# Altium project S7CAS-PLEIADES-CARTE-FILLE.PrjPCB (part 1 of 2)
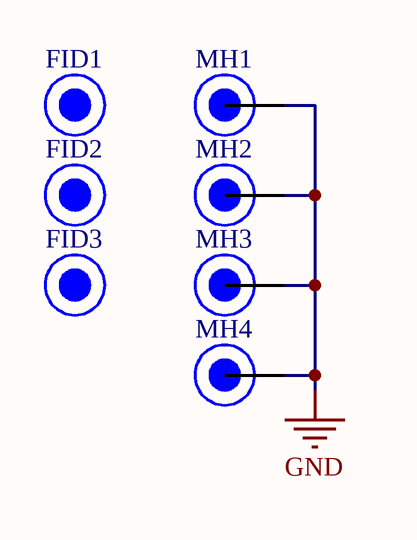
[diagram p0: CF_Title.SchDoc]
Project_Date: 2019-01-28; Project_DateCode: DCXXXX; Project_Designer1: Olivier Belval; Project_Designer2: Édouard Denommée; Project_Designer3: Philippe Marcoux; Project_Designer4: Anthony Paris; Project_Global: PLEIADES; Project_Group: P05; Project_Name: Carte Fille; Project_Revision: 1.000; Project_Stencil_Bot_Thickness: 0.1 MM; Project_Stencil_Top_Thickness: 0.1 MM
10 sheets, 201 parts. Net scope: flat (ports and power ports of the same name join across sheets).
Board file: CF_PCB.PcbDoc
Sheets:
  CF_Title.SchDoc
  CF_POWER_TREE.SchDoc
  CF_ALIM.SchDoc
  CF_DAC.SchDoc
  CF_DAC_FILTER.SchDoc
  CF_ADC.SchDoc
  CF_ADC_Supply.SchDoc
  CF_ADC_filter.SchDoc
  CF_FMC_ABC.SchDoc
  CF_FMC_DE.SchDoc

## Sheet CF_Title.SchDoc
size Tabloid; DocumentNumber: 1; SheetNumber: 1; SheetTotal: 10; Size: 11x17

### Parts
FID1  Fiducial 1mm  [FID_1MM]  (value not drawn)  (no BOM)
FID2  Fiducial 1mm  [FID_1MM]  (value not drawn)  (no BOM)
FID3  Fiducial 1mm  [FID_1MM]  (value not drawn)  (no BOM)
MH1  Mounting Hole 6-32  [MH_ENG_6-32]  (value not drawn)  (no BOM)
MH2  Mounting Hole 6-32  [MH_ENG_6-32]  (value not drawn)  (no BOM)
MH3  Mounting Hole 6-32  [MH_ENG_6-32]  (value not drawn)  (no BOM)
MH4  Mounting Hole 6-32  [MH_ENG_6-32]  (value not drawn)  (no BOM)

### Nets
GND: MH1.1 MH2.1 MH3.1 MH4.1

### Notes on the sheet
- Revision history
- Package size conversion
- Metric
- 1005
- 1608
- Imperial
- 0402
- 0603
- Revision
- 2012
- 3216
- 0805
- 1206
- 3225
- 6432
- 1210
- 2512
- Date :
- Project Title
- Global Project
- Size
- Group
- Date
- Sheet
- of
- Filename
- Designers

### Library data of the parts
FID1-FID3 = FID_1MM: FID - 1MM; Current: *; Mfg Part Number: *; HelpURL: *; CreatedBy: Jonathan Bouchard; VerifiedBy: Alexandre Imbeault; FootprintNameOK: Jonathan Bouchard; Temperature: *; Power: *; Precision: *; Value: *; Mfg: *; Package: *; Voltage: *
MH1-MH4 = MH_6-32: MH - Mounting Hole 6-32; Current: *; Mfg Part Number: *; HelpURL: *; CreatedBy: Jonathan Bouchard; VerifiedBy: Alexandre Imbeault; FootprintNameOK: Jonathan Bouchard; Temperature: *; Power: *; Precision: *; Value: *; Mfg: *; Package: *; Voltage: *

## Sheet CF_POWER_TREE.SchDoc
size Tabloid; DocumentNumber: 2; SheetNumber: 2; SheetTotal: 10; Size: 11x17; Sheet_Name: Power tree
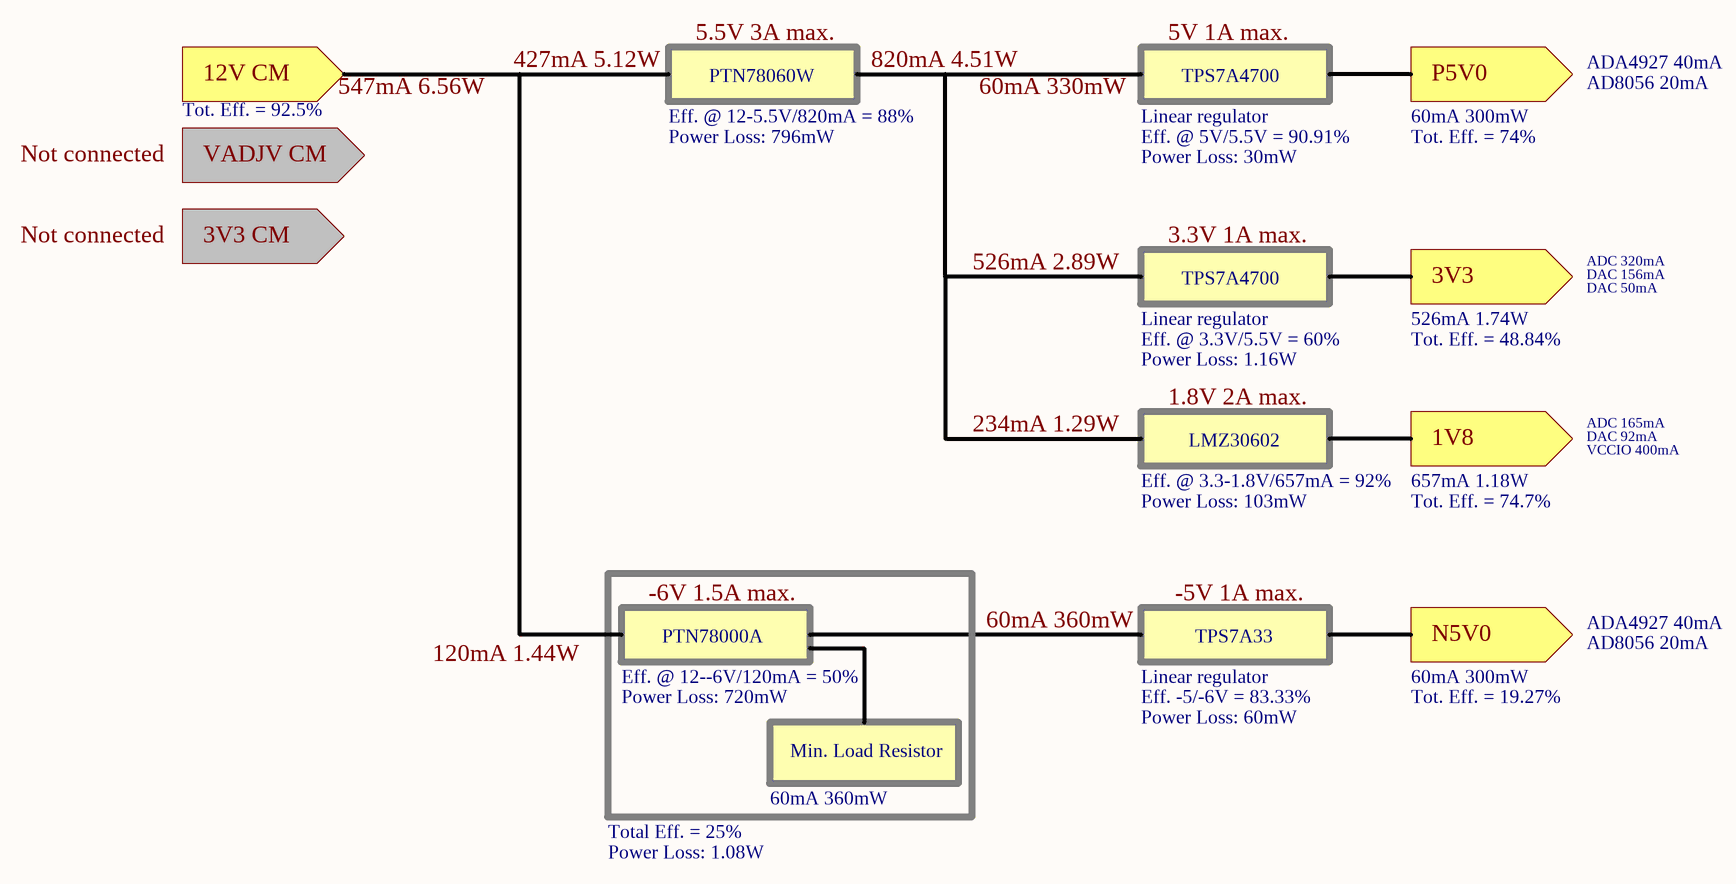
[diagram p1: CF_POWER_TREE.SchDoc]

### Notes on the sheet
- 5.5V 3A max.
- 5V 1A max.
- 12V CM
- 547mA 6.56W
- 427mA 5.12W
- PTN78060W
- 820mA 4.51W
- 60mA 330mW
- TPS7A4700
- P5V0
- ADA4927 40mA
- AD8056 20mA
- Not connected
- Tot. Eff. = 92.5%
- VADJV CM
- Power Loss: 796mW
- Eff. @ 12-5.5V/820mA = 88%
- Power Loss: 30mW
- Eff. @ 5V/5.5V = 90.91%
- Linear regulator
- 60mA 300mW
- Tot. Eff. = 74%
- 3V3 CM
- 526mA 2.89W
- 3.3V 1A max.
- 3V3
- ADC 320mA
- DAC 156mA
- DAC 50mA
- Power Loss: 1.16W
- Eff. @ 3.3V/5.5V = 60%
- 526mA 1.74W
- Tot. Eff. = 48.84%
- 234mA 1.29W
- 1.8V 2A max.
- LMZ30602
- 1V8
- ADC 165mA
- DAC 92mA
- Power Loss: 103mW
- Eff. @ 3.3-1.8V/657mA = 92%
- 657mA 1.18W
- Tot. Eff. = 74.7%
- VCCIO 400mA
- -6V 1.5A max.
- PTN78000A
- 60mA 360mW
- -5V 1A max.
- TPS7A33
- N5V0
- 120mA 1.44W
- Power Loss: 720mW
- Eff. @ 12--6V/120mA = 50%
- Eff. -5/-6V = 83.33%
- Tot. Eff. = 19.27%
- Min. Load Resistor
- Power Loss: 60mW
- Total Eff. = 25%
- Power Loss: 1.08W
- Sheet Name
- Project Title
- Global Project
- Size
- Group
- Revision
- Date
- Sheet
- of
- Filename
- Designers

## Sheet CF_ALIM.SchDoc: CF_ALIM
size Tabloid; DocumentNumber: 3; SheetNumber: 3; SheetTotal: 10; SheetName: test; Sheet_Name: CF_ALIM; Size: 11x17; DocumentName: CF_ALIM
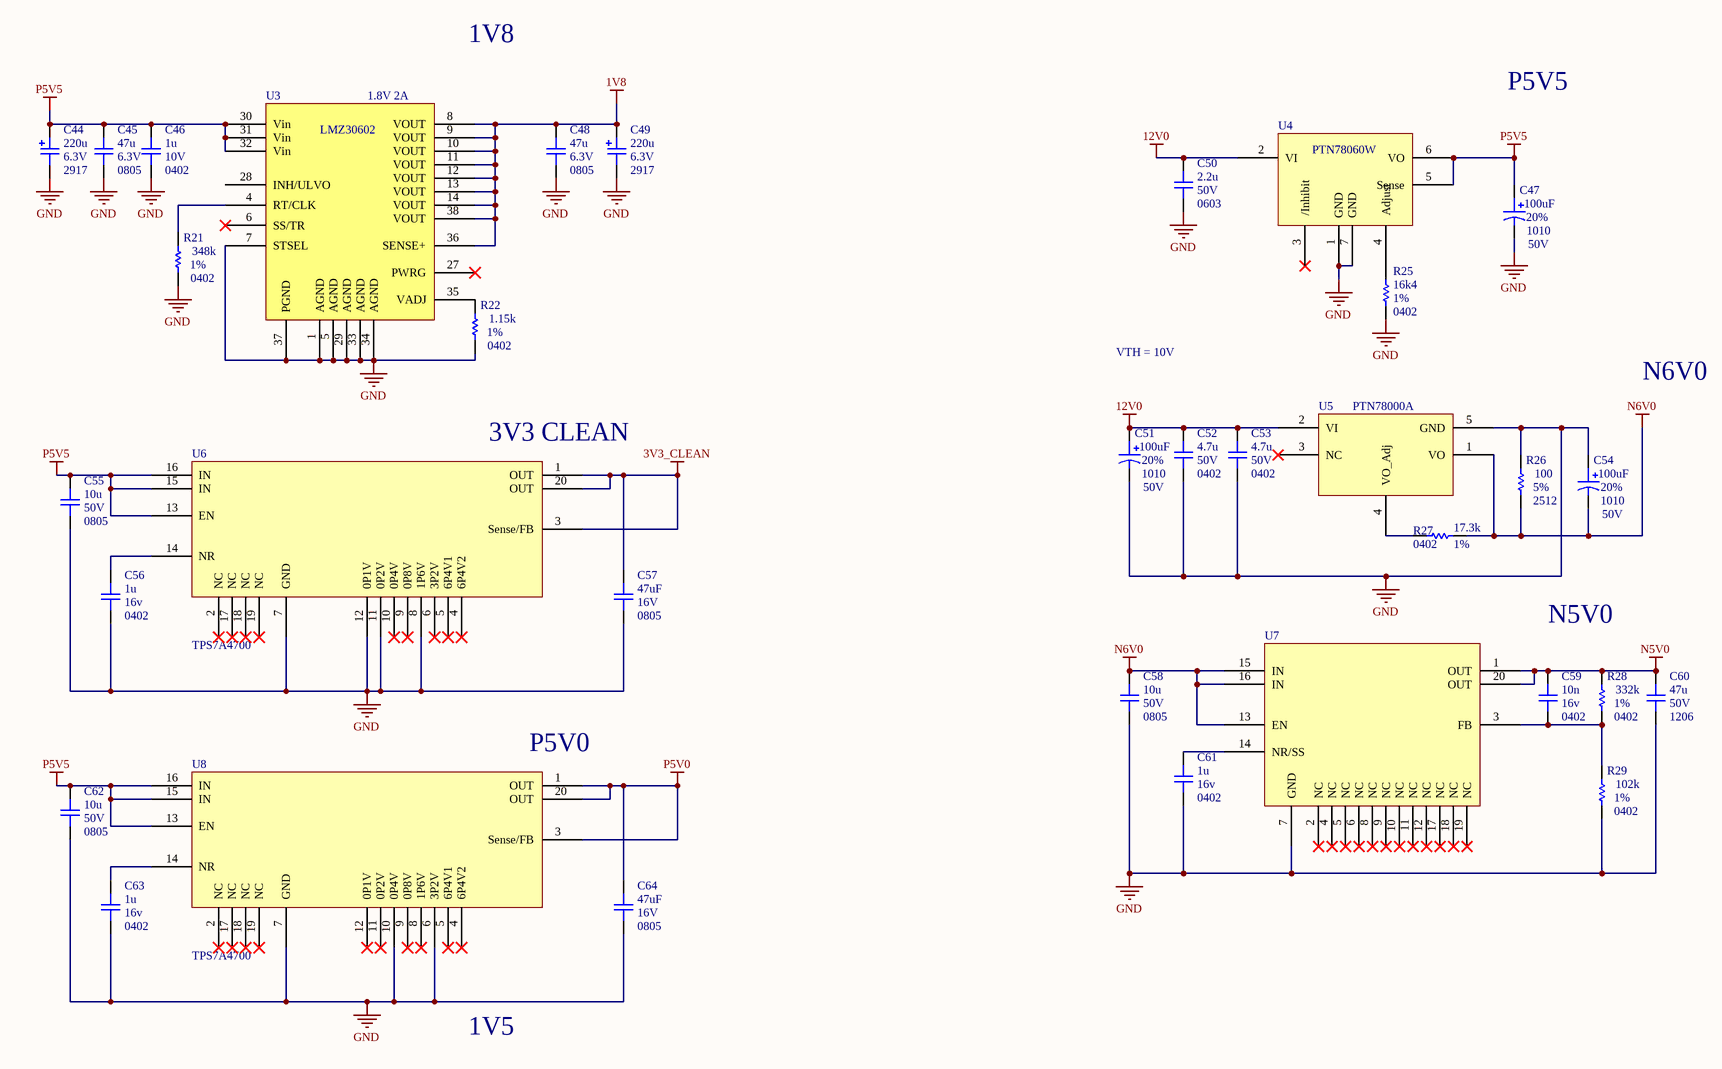
[diagram p2: CF_ALIM.SchDoc]

### Parts
C44  value 220u  Voltage: 6.3V  Package: 2917  [CAP_TAN_2917(D)]  (hidden comment: CAP - TANTALUM - CASE D)
C45  value 47u  Voltage: 6.3V  Package: 0805  [CAP_0805]  (hidden comment: CAP - 0805)
C46  value 1u  Voltage: 10V  Package: 0402  [CAP_0402]  (hidden comment: CAP - 0402)
C47  value 100uF  Voltage: 50V  Package: 1010  Precision: 20%  [CapacitorE]  (hidden comment: MAL215099101E3)
C48  value 47u  Voltage: 6.3V  Package: 0805  [CAP_0805]  (hidden comment: CAP - 0805)
C49  value 220u  Voltage: 6.3V  Package: 2917  [CAP_TAN_2917(D)]  (hidden comment: CAP - TANTALUM - CASE D)
C50  value 2.2u  Voltage: 50V  Package: 0603  [CAP_0603]  (hidden comment: CAP - 0603)
C51  value 100uF  Voltage: 50V  Package: 1010  Precision: 20%  [CapacitorE]  (hidden comment: MAL215099101E3)
C52  value 4.7u  Voltage: 50V  Package: 0402  [CAP_0402]  (hidden comment: CAP - 0402)
C53  value 4.7u  Voltage: 50V  Package: 0402  [CAP_0402]  (hidden comment: CAP - 0402)
C54  value 100uF  Voltage: 50V  Package: 1010  Precision: 20%  [CapacitorE]  (hidden comment: MAL215099101E3)
C55  value 10u  Voltage: 50V  Package: 0805  [CAP_0402]  (hidden comment: CAP - 0402)
C56  value 1u  Voltage: 16v  Package: 0402  [CAP_0402]  (hidden comment: CAP - 0402)
C57  value 47uF  Voltage: 16V  Package: 0805  [CAP_0805]  (hidden comment: CAP - 0805)
C58  value 10u  Voltage: 50V  Package: 0805  [CAP_0402]  (hidden comment: CAP - 0402)
C59  value 10n  Voltage: 16v  Package: 0402  [CAP_0402]  (hidden comment: CAP - 0402)
C60  value 47u  Voltage: 50V  Package: 1206  [CAP_1206]  (hidden comment: CAP - 1206)
C61  value 1u  Voltage: 16v  Package: 0402  [CAP_0402]  (hidden comment: CAP - 0402)
C62  value 10u  Voltage: 50V  Package: 0805  [CAP_0402]  (hidden comment: CAP - 0402)
C63  value 1u  Voltage: 16v  Package: 0402  [CAP_0402]  (hidden comment: CAP - 0402)
C64  value 47uF  Voltage: 16V  Package: 0805  [CAP_0805]  (hidden comment: CAP - 0805)
R21  value 348k  Package: 0402  Precision: 1%  [RES_0402]  (hidden comment: RES - 0402)
R22  value 1.15k  Package: 0402  Precision: 1%  [RES_0402]  (hidden comment: RES - 0402)
R25  value 16k4  Package: 0402  Precision: 1%  [RES_0402]  (hidden comment: RES - 0402)
R26  value 100  Package: 2512  Precision: 5%  [C2512]  (hidden comment: RES - 0402)
R27  value 17.3k  Package: 0402  Precision: 1%  [RES_0402]  (hidden comment: RES - 0402)
R28  value 332k  Package: 0402  Precision: 1%  [RES_0402]  (hidden comment: RES - 0402)
R29  value 102k  Package: 0402  Precision: 1%  [RES_0402]  (hidden comment: RES - 0402)
U3  LMZ30602  [RKG39 QFN]
U4  PTN78060W  [EUW]
U5  PTN78000A  [PTN78000A]
U6  TPS7A4700  [TPS7A4700]
U7  (no value)  [TPS7A4700]
U8  TPS7A4700  [TPS7A4700]

### Nets
1V8: C48.2 C49.2 U3.8(VOUT) U3.9(VOUT) U3.10(VOUT) U3.11(VOUT) U3.12(VOUT) U3.13(VOUT) U3.14(VOUT) U3.36(SENSE+) U3.38(VOUT)
3V3_CLEAN: C57.2 U6.1(OUT) U6.3(Sense/FB) U6.20(OUT)
12V0: C50.2 C51.1 C52.2 C53.2 U4.2(VI) U5.2(VI)
GND: C44.1 C45.1 C46.1 C47.2 C48.1 C49.1 C50.1 C51.2 C52.1 C53.1 C54.1 C55.1 C56.1 C57.1 C58.1 C60.1 C61.1 C62.1 C63.1 C64.1 R21.1 R22.1 R25.1 R26.2 R29.1 U3.1(AGND) U3.5(AGND) U3.7(STSEL) U3.29(AGND) U3.33(AGND) U3.34(AGND) U3.37(PGND) U4.1(GND) U4.7(GND) U5.5(GND) U6.7(GND) U6.8(1P6V) U6.11(0P2V) U6.12(0P1V) U7.7(GND) U8.6(3P2V) U8.7(GND) U8.10(0P4V)
N5V0: C59.2 C60.2 R28.2 U7.1(OUT) U7.20(OUT)
N6V0: C54.2 C58.2 R26.1 R27.1 U5.1(VO) U7.13(EN) U7.15(IN) U7.16(IN)
P5V0: C64.2 U8.1(OUT) U8.3(Sense/FB) U8.20(OUT)
P5V5: C44.2 C45.2 C46.2 C47.1 C55.2 C62.2 U3.30(Vin) U3.31(Vin) U3.32(Vin) U4.5(Sense) U4.6(VO) U6.13(EN) U6.15(IN) U6.16(IN) U8.13(EN) U8.15(IN) U8.16(IN)
NetC56_2: C56.2 U6.14(NR)
NetC59_1: C59.1 R28.1 R29.2 U7.3(FB)
NetC61_2: C61.2 U7.14(NR/SS)
NetC63_2: C63.2 U8.14(NR)
NetR21_2: R21.2 U3.4(RT/CLK)
NetR22_2: R22.2 U3.35(VADJ)
NetR25_2: R25.2 U4.4(Adjust)
NetR27_2: R27.2 U5.4(VO_Adj)

Not connected (* = marked no-connect by the designer): U3 6(SS/TR)* 27(PWRG)* 28(INH/ULVO); U4 3(/Inhibit)*; U5 3(NC)*; U6 2(NC)* 4(6P4V2)* 5(6P4V1)* 6(3P2V)* 9(0P8V)* 10(0P4V)* 17(NC)* 18(NC)* 19(NC)*; U7 2(NC)* 4(NC)* 5(NC)* 6(NC)* 8(NC)* 9(NC)* 10(NC)* 11(NC)* 12(NC)* 17(NC)* 18(NC)* 19(NC)*; U8 2(NC)* 4(6P4V2)* 5(6P4V1)* 8(1P6V)* 9(0P8V)* 11(0P2V)* 12(0P1V)* 17(NC)* 18(NC)* 19(NC)*

### Notes on the sheet
- (near U3) 1.8V 2A
- 1V8
- P5V5
- VTH = 10V
- N6V0
- (near U6) 3V3 CLEAN
- N5V0
- (near U8) P5V0
- 1V5
- Sheet Name
- Project Title
- Global Project
- Size
- Group
- Revision
- Date
- Sheet
- of
- Filename
- Designers

### Library data of the parts
C44 C49 = CAP_TANT_2917(D): CAP - TANTALUM - 2917; pin to pad: 1>2 2>1; Precision: 10%; Current: *; CreatedBy: Jonathan Bouchard; Power: *
C45 C48 C57 C64 = CAP - 0805: Precision: 10%; Current: *; CreatedBy: Jonathan Bouchard; Power: *
C46 C52 C53 C55 C56 C58 C59 C61-C63 = CAP - 0402: Precision: 10%; Current: *; CreatedBy: Jonathan Bouchard; Power: *
C47 C51 C54 = CAP_ALU_MAL215099101E3: CAP - ALU 100uF 20% 50V - 1010; pin to pad: 1>2 2>1; Current: 490mA; Mfg: Vishay Dale; Mfg Part Number: MAL215099101E3; HelpURL: http://www.vishay.com/docs/28395/150crz.pdf; CreatedBy: Jonathan Bouchard; Temperature: -55°C to 125°C; Power: *; Supplier 1: Digikey; Supplier Part Number 1: 4399PHDKR-ND
C50 = CAP - 0603: Precision: 10%; Current: *; CreatedBy: Jonathan Bouchard; Power: *
C60 = CAP - 1206: Precision: 10%; Current: *; CreatedBy: Jonathan Bouchard; Power: *
R21 R22 R25-R29 = RES - 0402: Voltage: 50V; Power: 1/16W; Current: *; CreatedBy: Jonathan Bouchard
U3 = LMZ3602: 2A Power Module
U4 = PTN78060W: Wide input volate regulator; Output Current: 3A
U7 = TPS7A33

## Sheet CF_DAC.SchDoc
size Tabloid; DocumentNumber: 4; SheetNumber: 4; SheetTotal: 10; Sheet_Name: CF_DAC; Size: 11x17
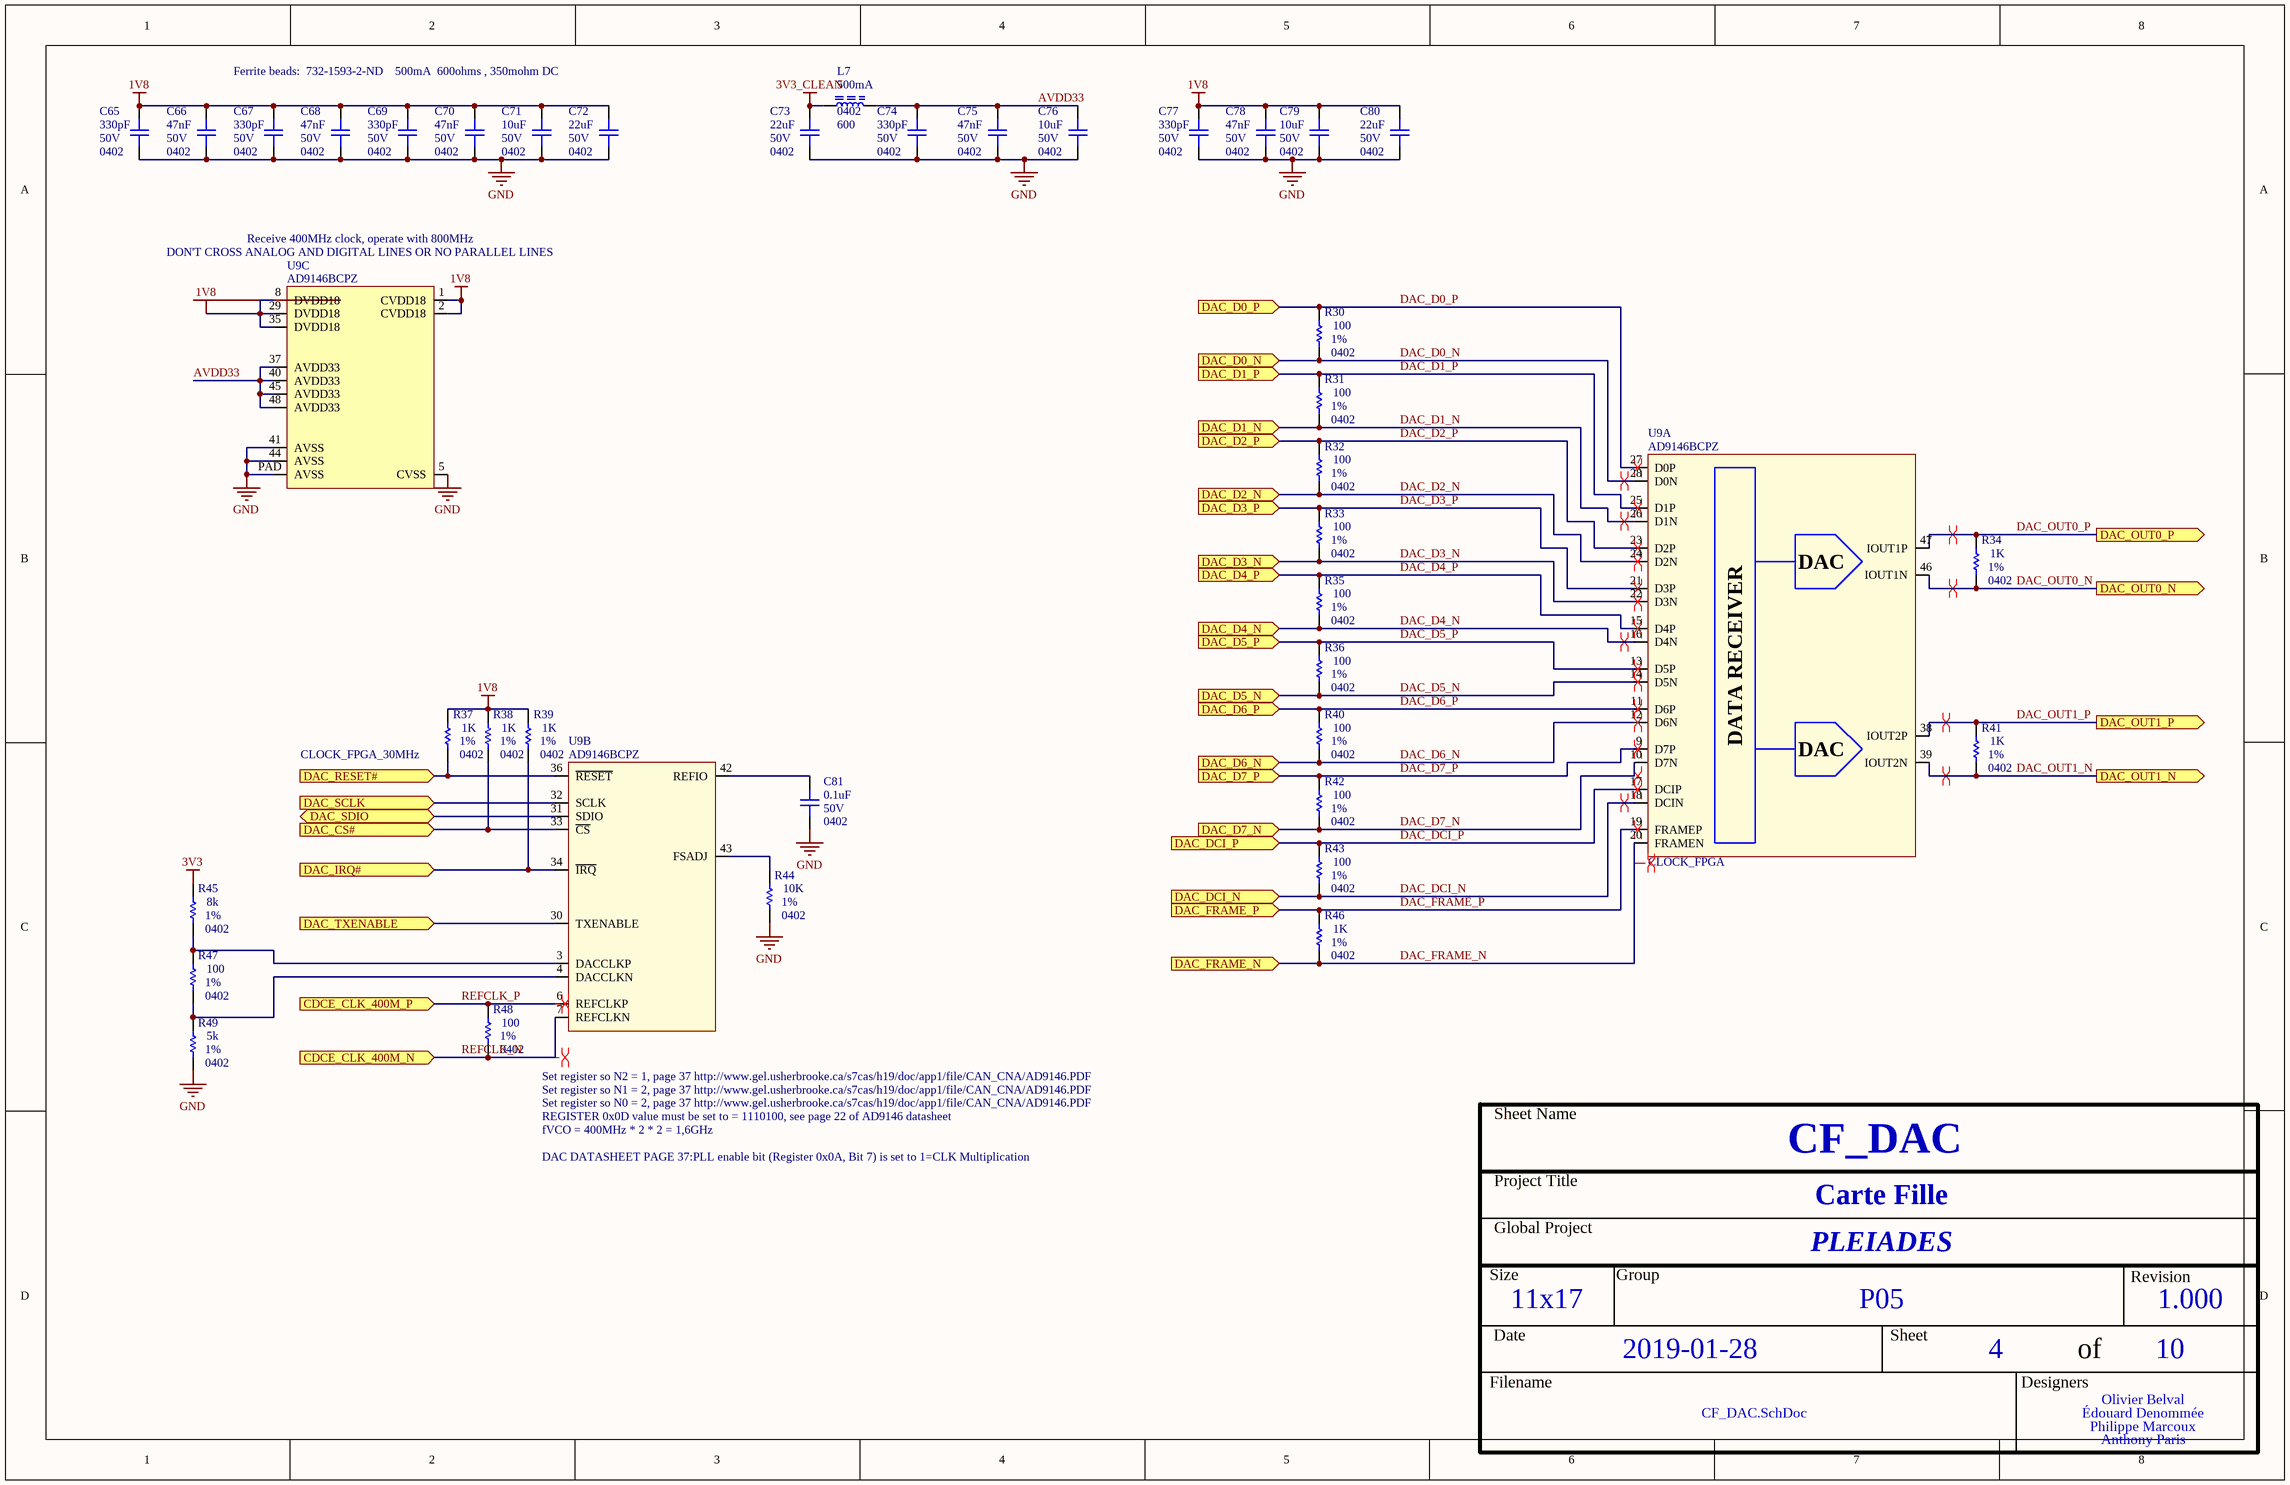
[diagram p3: CF_DAC.SchDoc]

### Parts
C65  value 330pF  Voltage: 50V  Package: 0402  [CAP_0402]  (hidden comment: CAP - 0402)
C66  value 47nF  Voltage: 50V  Package: 0402  [CAP_0402]  (hidden comment: CAP - 0402)
C67  value 330pF  Voltage: 50V  Package: 0402  [CAP_0402]  (hidden comment: CAP - 0402)
C68  value 47nF  Voltage: 50V  Package: 0402  [CAP_0402]  (hidden comment: CAP - 0402)
C69  value 330pF  Voltage: 50V  Package: 0402  [CAP_0402]  (hidden comment: CAP - 0402)
C70  value 47nF  Voltage: 50V  Package: 0402  [CAP_0402]  (hidden comment: CAP - 0402)
C71  value 10uF  Voltage: 50V  Package: 0402  [CAP_0402]  (hidden comment: CAP - 0402)
C72  value 22uF  Voltage: 50V  Package: 0402  [CAP_0402]  (hidden comment: CAP - 0402)
C73  value 22uF  Voltage: 50V  Package: 0402  [CAP_0402]  (hidden comment: CAP - 0402)
C74  value 330pF  Voltage: 50V  Package: 0402  [CAP_0402]  (hidden comment: CAP - 0402)
C75  value 47nF  Voltage: 50V  Package: 0402  [CAP_0402]  (hidden comment: CAP - 0402)
C76  value 10uF  Voltage: 50V  Package: 0402  [CAP_0402]  (hidden comment: CAP - 0402)
C77  value 330pF  Voltage: 50V  Package: 0402  [CAP_0402]  (hidden comment: CAP - 0402)
C78  value 47nF  Voltage: 50V  Package: 0402  [CAP_0402]  (hidden comment: CAP - 0402)
C79  value 10uF  Voltage: 50V  Package: 0402  [CAP_0402]  (hidden comment: CAP - 0402)
C80  value 22uF  Voltage: 50V  Package: 0402  [CAP_0402]  (hidden comment: CAP - 0402)
C81  value 0.1uF  Voltage: 50V  Package: 0402  [CAP_0402]  (hidden comment: CAP - 0402)
L7  value 600  Current: 500mA  Package: 0402  [FER_0402]  (hidden comment: FER - 0402)
R30  value 100  Package: 0402  Precision: 1%  [RES_0402]  (hidden comment: RES - 0402)
R31  value 100  Package: 0402  Precision: 1%  [RES_0402]  (hidden comment: RES - 0402)
R32  value 100  Package: 0402  Precision: 1%  [RES_0402]  (hidden comment: RES - 0402)
R33  value 100  Package: 0402  Precision: 1%  [RES_0402]  (hidden comment: RES - 0402)
R34  value 1K  Package: 0402  Precision: 1%  [RES_0402]  (hidden comment: RES - 0402)
R35  value 100  Package: 0402  Precision: 1%  [RES_0402]  (hidden comment: RES - 0402)
R36  value 100  Package: 0402  Precision: 1%  [RES_0402]  (hidden comment: RES - 0402)
R37  value 1K  Package: 0402  Precision: 1%  [RES_0402]  (hidden comment: RES - 0402)
R38  value 1K  Package: 0402  Precision: 1%  [RES_0402]  (hidden comment: RES - 0402)
R39  value 1K  Package: 0402  Precision: 1%  [RES_0402]  (hidden comment: RES - 0402)
R40  value 100  Package: 0402  Precision: 1%  [RES_0402]  (hidden comment: RES - 0402)
R41  value 1K  Package: 0402  Precision: 1%  [RES_0402]  (hidden comment: RES - 0402)
R42  value 100  Package: 0402  Precision: 1%  [RES_0402]  (hidden comment: RES - 0402)
R43  value 100  Package: 0402  Precision: 1%  [RES_0402]  (hidden comment: RES - 0402)
R44  value 10K  Package: 0402  Precision: 1%  [RES_0402]  (hidden comment: RES - 0402)
R45  value 8k  Package: 0402  Precision: 1%  [RES_0402]  (hidden comment: RES - 0402)
R46  value 1K  Package: 0402  Precision: 1%  [RES_0402]  (hidden comment: RES - 0402)
R47  value 100  Package: 0402  Precision: 1%  [RES_0402]  (hidden comment: RES - 0402)
R48  value 100  Package: 0402  Precision: 1%  [RES_0402]  (hidden comment: RES - 0402)
R49  value 5k  Package: 0402  Precision: 1%  [RES_0402]  (hidden comment: RES - 0402)
U9  AD9146BCPZ  [DAC_AD9146BCPZ]  (parts A,B,C of 3)

### Ports
CDCE_CLK_400M_N (in), CDCE_CLK_400M_P (in), DAC_CS# (in), DAC_D0_N (in), DAC_D0_P (in), DAC_D1_N (in), DAC_D1_P (in), DAC_D2_N (in), DAC_D2_P (in), DAC_D3_N (in), DAC_D3_P (in), DAC_D4_N (in), DAC_D4_P (in), DAC_D5_N (in), DAC_D5_P (in), DAC_D6_N (in), DAC_D6_P (in), DAC_D7_N (in), DAC_D7_P (in), DAC_DCI_N (in), DAC_DCI_P (in), DAC_FRAME_N (in), DAC_FRAME_P (in), DAC_IRQ# (in), DAC_OUT0_N (out), DAC_OUT0_P (out), DAC_OUT1_N (out), DAC_OUT1_P (out), DAC_RESET# (in), DAC_SCLK (in), DAC_SDIO (bidir), DAC_TXENABLE (in)

### Nets
1V8: C65.2 C66.2 C67.2 C68.2 C69.2 C70.2 C71.2 C72.2 C77.2 C78.2 C79.2 C80.2 R37.2 R38.2 R39.2 U9.1(CVDD18) U9.2(CVDD18) U9.8(DVDD18) U9.29(DVDD18) U9.35(DVDD18)
3V3: R45.2
3V3_CLEAN: C73.2 L7.2
GND: C65.1 C66.1 C67.1 C68.1 C69.1 C70.1 C71.1 C72.1 C73.1 C74.1 C75.1 C76.1 C77.1 C78.1 C79.1 C80.1 C81.1 R44.1 R49.1 U9.5(CVSS) U9.41(AVSS) U9.44(AVSS) U9.PAD(AVSS)
AVDD33: C74.2 C75.2 C76.2 L7.1 U9.37(AVDD33) U9.40(AVDD33) U9.45(AVDD33) U9.48(AVDD33)
DAC_D0_N: R30.1 U9.28(D0N) ; port DAC_D0_N
DAC_D0_P: R30.2 U9.27(D0P) ; port DAC_D0_P
DAC_D1_N: R31.1 U9.26(D1N) ; port DAC_D1_N
DAC_D1_P: R31.2 U9.25(D1P) ; port DAC_D1_P
DAC_D2_N: R32.1 U9.24(D2N) ; port DAC_D2_N
DAC_D2_P: R32.2 U9.23(D2P) ; port DAC_D2_P
DAC_D3_N: R33.1 U9.22(D3N) ; port DAC_D3_N
DAC_D3_P: R33.2 U9.21(D3P) ; port DAC_D3_P
DAC_D4_N: R35.1 U9.16(D4N) ; port DAC_D4_N
DAC_D4_P: R35.2 U9.15(D4P) ; port DAC_D4_P
DAC_D5_N: R36.1 U9.14(D5N) ; port DAC_D5_N
DAC_D5_P: R36.2 U9.13(D5P) ; port DAC_D5_P
DAC_D6_N: R40.1 U9.12(D6N) ; port DAC_D6_N
DAC_D6_P: R40.2 U9.11(D6P) ; port DAC_D6_P
DAC_D7_N: R42.1 U9.10(D7N) ; port DAC_D7_N
DAC_D7_P: R42.2 U9.9(D7P) ; port DAC_D7_P
DAC_DCI_N: R43.1 U9.18(DCIN) ; port DAC_DCI_N
DAC_DCI_P: R43.2 U9.17(DCIP) ; port DAC_DCI_P
DAC_FRAME_N: R46.1 U9.20(FRAMEN) ; port DAC_FRAME_N
DAC_FRAME_P: R46.2 U9.19(FRAMEP) ; port DAC_FRAME_P
DAC_OUT0_N: R34.1 U9.46(IOUT1N) ; port DAC_OUT0_N
DAC_OUT0_P: R34.2 U9.47(IOUT1P) ; port DAC_OUT0_P
DAC_OUT1_N: R41.1 U9.39(IOUT2N) ; port DAC_OUT1_N
DAC_OUT1_P: R41.2 U9.38(IOUT2P) ; port DAC_OUT1_P
REFCLK_N: R48.1 U9.7(REFCLKN) ; port CDCE_CLK_400M_N
REFCLK_P: R48.2 U9.6(REFCLKP) ; port CDCE_CLK_400M_P
NetC81_2: C81.2 U9.42(REFIO)
NetJ5_E21: R37.1 U9.36(~{RESET}) ; port DAC_RESET#
NetJ5_E24: R39.1 U9.34(~{IRQ}) ; port DAC_IRQ#
NetJ5_E25: R38.1 U9.33(~{CS}) ; port DAC_CS#
NetJ5_F25: U9.31(SDIO) ; port DAC_SDIO
NetJ5_F26: U9.32(SCLK) ; port DAC_SCLK
NetJ5_J28: U9.30(TXENABLE) ; port DAC_TXENABLE
NetR44_2: R44.2 U9.43(FSADJ)
NetR45_1: R45.1 R47.2 U9.3(DACCLKP)
NetR47_1: R47.1 R49.2 U9.4(DACCLKN)

### Layout directives
differential pair: DAC_D0_N, DAC_D0_P, DAC_D1_N, DAC_D1_P, DAC_D2_N, DAC_D2_P, DAC_D3_N, DAC_D3_P, DAC_D4_N, DAC_D4_P, DAC_D5_N, DAC_D5_P, DAC_D6_N, DAC_D6_P, DAC_D7_N, DAC_D7_P, DAC_DCI_N, DAC_DCI_P, DAC_FRAME_N, DAC_FRAME_P, DAC_OUT0_N, DAC_OUT0_P, DAC_OUT1_N, DAC_OUT1_P, REFCLK_N, REFCLK_P

### Notes on the sheet
- Ferrite beads:  732-1593-2-ND    500mA  600ohms , 350mohm DC
- (near U9) DON'T CROSS ANALOG AND DIGITAL LINES OR NO PARALLEL LINES
- Receive 400MHz clock, operate with 800MHz
- (near R37) CLOCK_FPGA_30MHz
- (near U9) CLOCK_FPGA
- Set register so N1 = 2, page 37 http://www.gel.usherbrooke.ca/s7cas/h19/doc/app1/file/CAN_CNA/AD9146.PDF
- Set register so N2 = 1, page 37 http://www.gel.usherbrooke.ca/s7cas/h19/doc/app1/file/CAN_CNA/AD9146.PDF
- Set register so N0 = 2, page 37 http://www.gel.usherbrooke.ca/s7cas/h19/doc/app1/file/CAN_CNA/AD9146.PDF
- DAC DATASHEET PAGE 37:PLL enable bit (Register 0x0A, Bit 7) is set to 1=CLK Multiplication
- fVCO = 400MHz * 2 * 2 = 1,6GHz
- REGISTER 0x0D value must be set to = 1110100, see page 22 of AD9146 datasheet
- Sheet Name
- Project Title
- Global Project
- Size
- Group
- Revision
- Date
- Sheet
- of
- Filename
- Designers
- (in symbol DAC_AD9146BCPZ, part A) DAC; DATA RECEIVER

### Library data of the parts
C65-C81 = CAP - 0402: Precision: 10%; Current: *; CreatedBy: Jonathan Bouchard; Power: *
R30-R49 = RES - 0402: Voltage: 50V; Power: 1/16W; Current: *; CreatedBy: Jonathan Bouchard
U9 = DAC_AD9146BCPZ: DAC - 16BIT SRL HIGH SPEED - QFN-48; Voltage: 3.13 V ~ 3.47 V / 1.71 V ~ 1.89 V; Mfg: Analog Devices Inc.; Current: *; Power: *; Mfg Part Number: AD9146BCPZ; HelpURL: http://www.analog.com/media/en/technical-documentation/data-sheets/AD9146.PDF; CreatedBy: Jonathan Bouchard; Temperature: -40°C ~ 85°C; Value: *; Precision: 16 Bit; Package: QFN-48; Supplier 1: Digikey; Supplier Part Number 1: AD9146BCPZ-ND
L7 = FER - 0402: Voltage: *; CreatedBy: Jonathan Bouchard; Power: *; Precision: *

## Sheet CF_DAC_FILTER.SchDoc
size Tabloid; DocumentNumber: 5; SheetNumber: 5; SheetTotal: 10; Size: 11x17; Sheet_Name: CF_DAC_FILTER
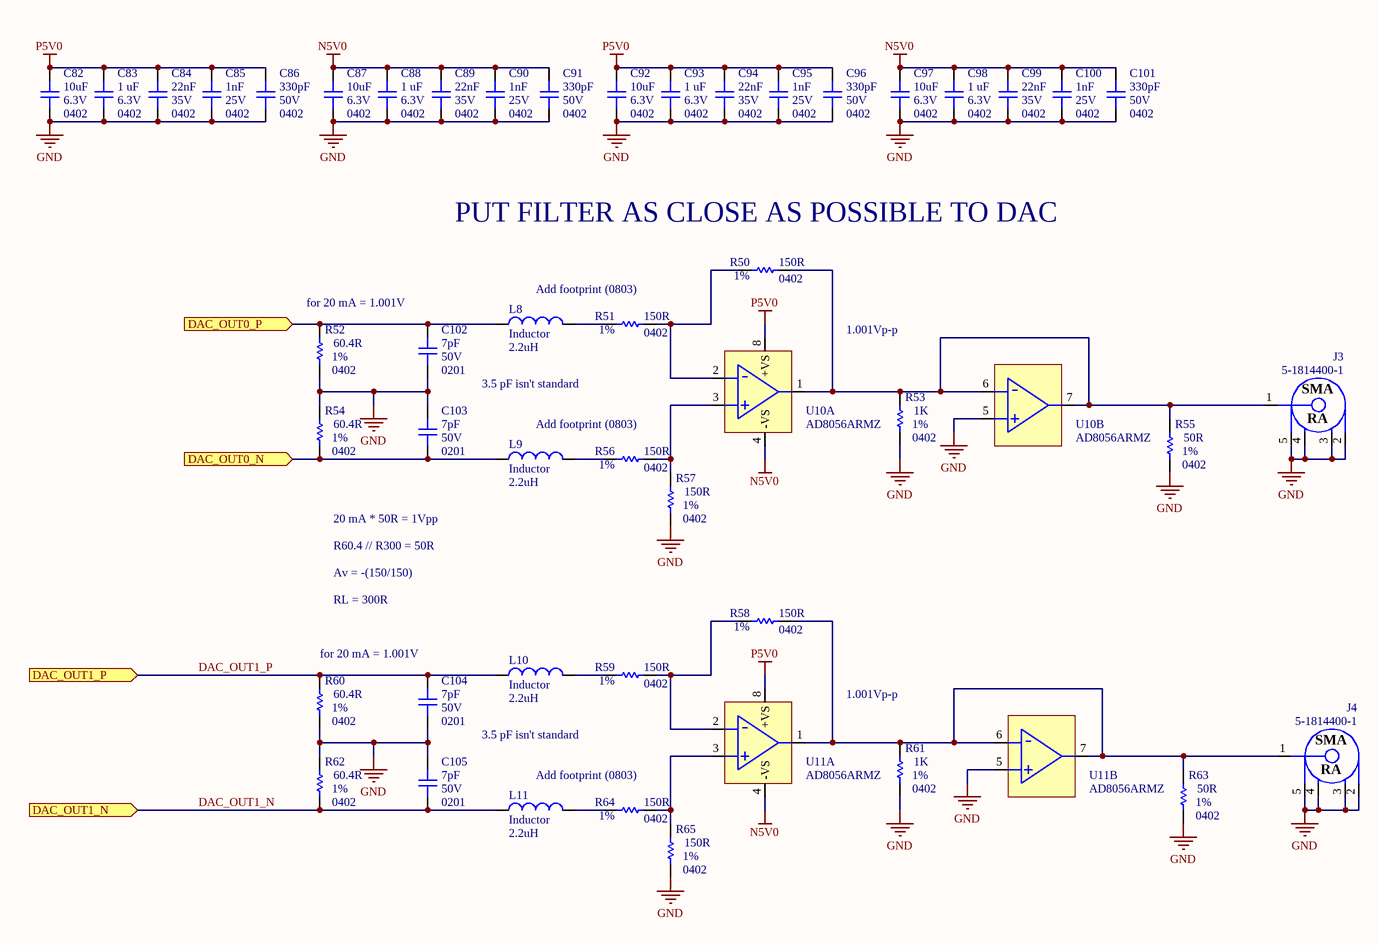
[diagram p4: CF_DAC_FILTER.SchDoc]

### Parts
C82  value 10uF  Voltage: 6.3V  Package: 0402  [CAP_0402]  (hidden comment: CAP - 0402)
C83  value 1 uF  Voltage: 6.3V  Package: 0402  [CAP_0402]  (hidden comment: CAP - 0402)
C84  value 22nF  Voltage: 35V  Package: 0402  [CAP_0402]  (hidden comment: CAP - 0402)
C85  value 1nF  Voltage: 25V  Package: 0402  [CAP_0402]  (hidden comment: CAP - 0402)
C86  value 330pF  Voltage: 50V  Package: 0402  [CAP_0402]  (hidden comment: CAP - 0402)
C87  value 10uF  Voltage: 6.3V  Package: 0402  [CAP_0402]  (hidden comment: CAP - 0402)
C88  value 1 uF  Voltage: 6.3V  Package: 0402  [CAP_0402]  (hidden comment: CAP - 0402)
C89  value 22nF  Voltage: 35V  Package: 0402  [CAP_0402]  (hidden comment: CAP - 0402)
C90  value 1nF  Voltage: 25V  Package: 0402  [CAP_0402]  (hidden comment: CAP - 0402)
C91  value 330pF  Voltage: 50V  Package: 0402  [CAP_0402]  (hidden comment: CAP - 0402)
C92  value 10uF  Voltage: 6.3V  Package: 0402  [CAP_0402]  (hidden comment: CAP - 0402)
C93  value 1 uF  Voltage: 6.3V  Package: 0402  [CAP_0402]  (hidden comment: CAP - 0402)
C94  value 22nF  Voltage: 35V  Package: 0402  [CAP_0402]  (hidden comment: CAP - 0402)
C95  value 1nF  Voltage: 25V  Package: 0402  [CAP_0402]  (hidden comment: CAP - 0402)
C96  value 330pF  Voltage: 50V  Package: 0402  [CAP_0402]  (hidden comment: CAP - 0402)
C97  value 10uF  Voltage: 6.3V  Package: 0402  [CAP_0402]  (hidden comment: CAP - 0402)
C98  value 1 uF  Voltage: 6.3V  Package: 0402  [CAP_0402]  (hidden comment: CAP - 0402)
C99  value 22nF  Voltage: 35V  Package: 0402  [CAP_0402]  (hidden comment: CAP - 0402)
C100  value 1nF  Voltage: 25V  Package: 0402  [CAP_0402]  (hidden comment: CAP - 0402)
C101  value 330pF  Voltage: 50V  Package: 0402  [CAP_0402]  (hidden comment: CAP - 0402)
C102  value 7pF  Voltage: 50V  Package: 0201  [CAP_0201]  (hidden comment: CAP - 0201)
C103  value 7pF  Voltage: 50V  Package: 0201  [CAP_0201]  (hidden comment: CAP - 0201)
C104  value 7pF  Voltage: 50V  Package: 0201  [CAP_0201]  (hidden comment: CAP - 0201)
C105  value 7pF  Voltage: 50V  Package: 0201  [CAP_0201]  (hidden comment: CAP - 0201)
J3  5-1814400-1  [CONN_SMA_5-1814400-1]
J4  5-1814400-1  [CONN_SMA_5-1814400-1]
L8  Inductor  value 2.2uH  [0402-A]
L9  Inductor  value 2.2uH  [0402-A]
L10  Inductor  value 2.2uH  [0402-A]
L11  Inductor  value 2.2uH  [0402-A]
R50  value 150R  Package: 0402  Precision: 1%  [RES_0402]  (hidden comment: RES - 0402)
R51  value 150R  Package: 0402  Precision: 1%  [RES_0402]  (hidden comment: RES - 0402)
R52  value 60.4R  Package: 0402  Precision: 1%  [RES_0402]  (hidden comment: RES - 0402)
R53  value 1K  Package: 0402  Precision: 1%  [RES_0402]  (hidden comment: RES - 0402)
R54  value 60.4R  Package: 0402  Precision: 1%  [RES_0402]  (hidden comment: RES - 0402)
R55  value 50R  Package: 0402  Precision: 1%  [RES_0402]  (hidden comment: RES - 0402)
R56  value 150R  Package: 0402  Precision: 1%  [RES_0402]  (hidden comment: RES - 0402)
R57  value 150R  Package: 0402  Precision: 1%  [RES_0402]  (hidden comment: RES - 0402)
R58  value 150R  Package: 0402  Precision: 1%  [RES_0402]  (hidden comment: RES - 0402)
R59  value 150R  Package: 0402  Precision: 1%  [RES_0402]  (hidden comment: RES - 0402)
R60  value 60.4R  Package: 0402  Precision: 1%  [RES_0402]  (hidden comment: RES - 0402)
R61  value 1K  Package: 0402  Precision: 1%  [RES_0402]  (hidden comment: RES - 0402)
R62  value 60.4R  Package: 0402  Precision: 1%  [RES_0402]  (hidden comment: RES - 0402)
R63  value 50R  Package: 0402  Precision: 1%  [RES_0402]  (hidden comment: RES - 0402)
R64  value 150R  Package: 0402  Precision: 1%  [RES_0402]  (hidden comment: RES - 0402)
R65  value 150R  Package: 0402  Precision: 1%  [RES_0402]  (hidden comment: RES - 0402)
U10  AD8056ARMZ  [OPAMP_AD8056ARMZ]  (parts A,B of 2)
U11  AD8056ARMZ  [OPAMP_AD8056ARMZ]  (parts A,B of 2)

### Ports
DAC_OUT0_N (in), DAC_OUT0_P (in), DAC_OUT1_N (in), DAC_OUT1_P (in)

### Nets
GND: C82.1 C83.1 C84.1 C85.1 C86.1 C87.1 C88.1 C89.1 C90.1 C91.1 C92.1 C93.1 C94.1 C95.1 C96.1 C97.1 C98.1 C99.1 C100.1 C101.1 C102.1 C103.2 C104.1 C105.2 J3.2 J3.3 J3.4 J3.5 J4.2 J4.3 J4.4 J4.5 R52.1 R53.1 R54.2 R55.1 R57.1 R60.1 R61.1 R62.2 R63.1 R65.1 U10.5(+IN2) U11.5(+IN2)
N5V0: C87.2 C88.2 C89.2 C90.2 C91.2 C97.2 C98.2 C99.2 C100.2 C101.2 U10.4(-VS) U11.4(-VS)
P5V0: C82.2 C83.2 C84.2 C85.2 C86.2 C92.2 C93.2 C94.2 C95.2 C96.2 U10.8(+VS) U11.8(+VS)
DAC_OUT0_N: C103.1 L9.1 R54.1 ; port DAC_OUT0_N
DAC_OUT0_P: C102.2 L8.1 R52.2 ; port DAC_OUT0_P
DAC_OUT1_N: C105.1 L11.1 R62.1 ; port DAC_OUT1_N
DAC_OUT1_P: C104.2 L10.1 R60.2 ; port DAC_OUT1_P
NetJ3_1: J3.1 R50.1 R53.2 R55.2 U10.1(OUT1) U10.6(-IN2) U10.7(OUT2)
NetJ4_1: J4.1 R58.1 R61.2 R63.2 U11.1(OUT1) U11.6(-IN2) U11.7(OUT2)
NetL8_2: L8.2 R51.2
NetL9_2: L9.2 R56.2
NetL10_2: L10.2 R59.2
NetL11_2: L11.2 R64.2
NetR50_2: R50.2 R51.1 U10.2(-IN1)
NetR56_1: R56.1 R57.2 U10.3(+IN1)
NetR58_2: R58.2 R59.1 U11.2(-IN1)
NetR64_1: R64.1 R65.2 U11.3(+IN1)

### Notes on the sheet
- (near R50) PUT FILTER AS CLOSE AS POSSIBLE TO DAC
- for 20 mA = 1.001V
- Add footprint (0803)
- 1.001Vp-p
- 3.5 pF isn't standard
- 20 mA * 50R = 1Vpp
- R60.4 // R300 = 50R
- Av = -(150/150)
- RL = 300R
- Sheet Name
- Project Title
- Global Project
- Size
- Group
- Revision
- Date
- Sheet
- of
- Filename
- Designers
- (in symbol CONN_SMA_5-1814400-1) SMA; RA

### Library data of the parts
C82-C101 = CAP - 0402: Precision: 10%; Current: *; CreatedBy: Jonathan Bouchard; Power: *
C102-C105 = CAP - 0201: Precision: 10%; Current: *; CreatedBy: Jonathan Bouchard; Power: *
J3 J4 = CONN_SMA_5-1814400-1: CONN -  SMA JACK R/A 50 OHM - TH; Mfg: TE Connectivity AMP Connectors; Voltage: *; Current: *; Power: *; Mfg Part Number: 5-1814400-1; HelpURL: http://www.te.com/commerce/DocumentDelivery/DDEController?Action=srchrtrv&DocNm=1814400&DocType=Customer+Drawing&DocLang=English; CreatedBy: Jonathan Bouchard; Temperature: -55°C ~ 85°C; Value: *; Precision: *; Package: TH-5; Supplier 1: Digikey; Supplier Part Number 1: A97593-ND
L8-L11 = Inductor: Code_IEC: 1005; Published: 8-Jun-2000; LatestRevisionDate: 29-May-2009; LatestRevisionNote: IPC-7351 Footprint Added.; PackageReference: 0402-A; Publisher: Altium Limited; PackageDescription: Chip Inductor; Code_JEITA: 0402
R50-R65 = RES - 0402: Voltage: 50V; Power: 1/16W; Current: *; CreatedBy: Jonathan Bouchard
U10 U11 = OPAMP_AD8056ARMZ: OPAMP - VFB 300MHZ - 8MSOP; Voltage: 8 V ~ 12 V, ±4 V ~ 6 V; Current: 60mA; Mfg: Analog Devices; Power: *; Mfg Part Number: AD8056ARMZ; HelpURL: http://www.analog.com/media/en/technical-documentation/data-sheets/AD8055_8056.pdf; CreatedBy: Jonathan Bouchard; Temperature: -40°C ~ 125°C; Value: *; Precision: *; Package: MSOP-8; Supplier 1: Digikey; Supplier Part Number 1: AD8056ARMZ-REEL7CT-ND

## Sheet CF_ADC.SchDoc
size Tabloid; DocumentNumber: 6; SheetNumber: 6; SheetTotal: 10; Sheet_Name: CF_ADC; Size: 11x17
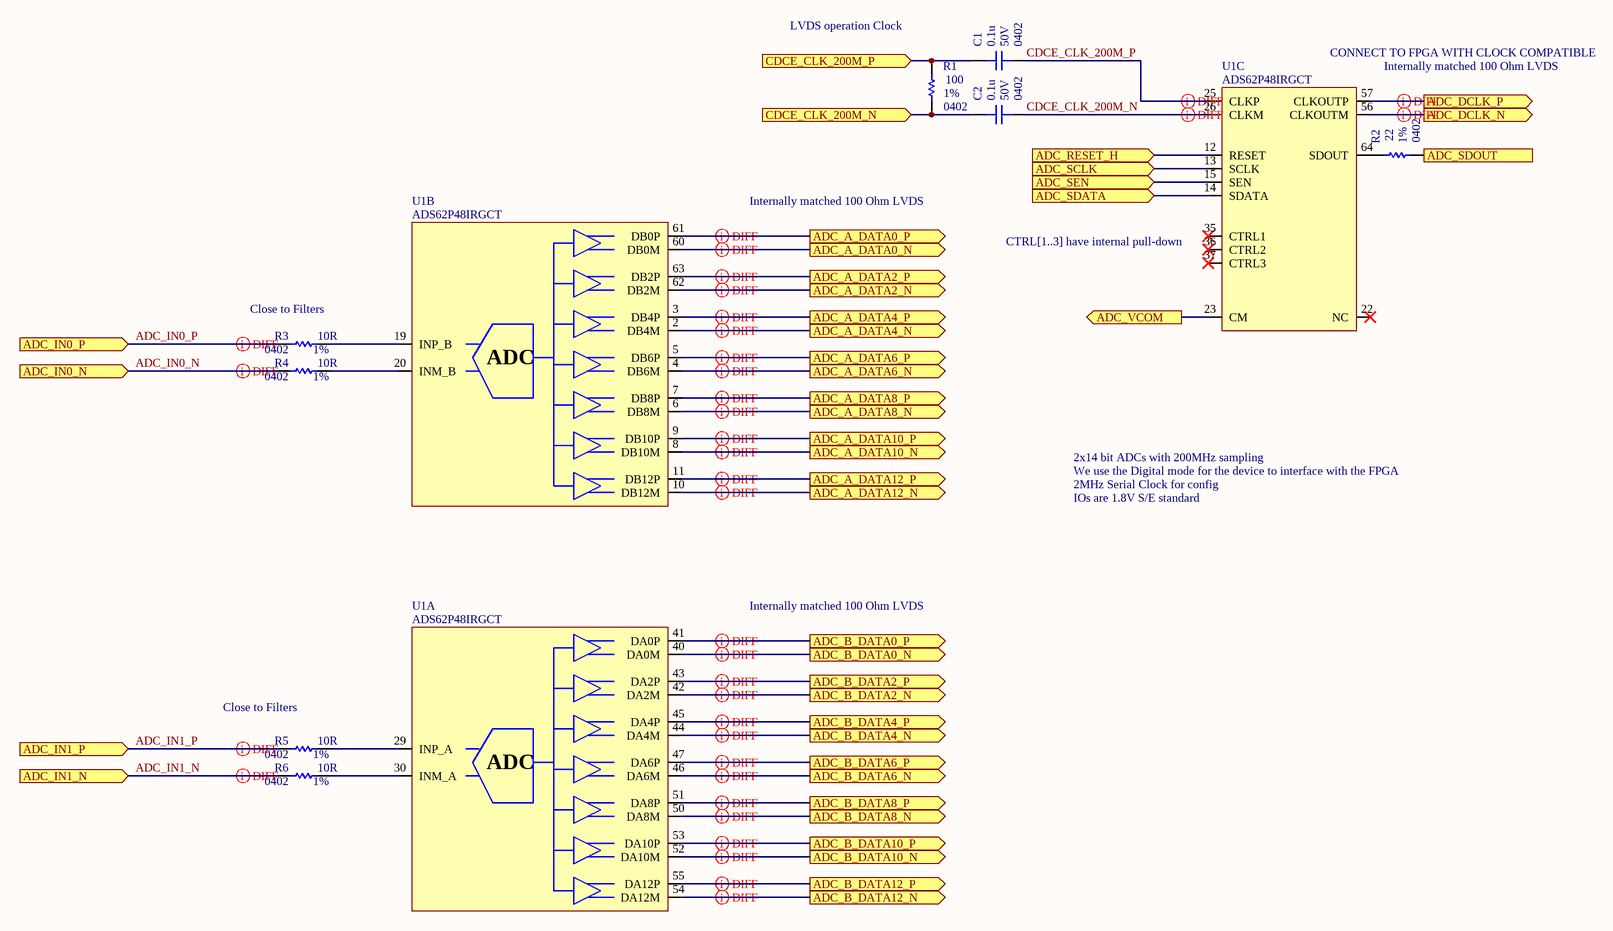
[diagram p5: CF_ADC.SchDoc]

### Parts
C1  value 0.1u  Voltage: 50V  Package: 0402  [CAP_0402]  (hidden comment: CAP - 0402)
C2  value 0.1u  Voltage: 50V  Package: 0402  [CAP_0402]  (hidden comment: CAP - 0402)
R1  value 100  Package: 0402  Precision: 1%  [RES_0402]  (hidden comment: RES - 0402)
R2  value 22  Package: 0402  Precision: 1%  [RES_0402]  (hidden comment: RES - 0402)
R3  value 10R  Package: 0402  Precision: 1%  [RES_0402]  (hidden comment: RES - 0402)
R4  value 10R  Package: 0402  Precision: 1%  [RES_0402]  (hidden comment: RES - 0402)
R5  value 10R  Package: 0402  Precision: 1%  [RES_0402]  (hidden comment: RES - 0402)
R6  value 10R  Package: 0402  Precision: 1%  [RES_0402]  (hidden comment: RES - 0402)
U1  ADS62P48IRGCT  [ADC_ADS62P48IRGCT]  (parts A,B,C of 4)

### Ports
ADC_A_DATA0_N (out), ADC_A_DATA0_P (out), ADC_A_DATA2_N (out), ADC_A_DATA2_P (out), ADC_A_DATA4_N (out), ADC_A_DATA4_P (out), ADC_A_DATA6_N (out), ADC_A_DATA6_P (out), ADC_A_DATA8_N (out), ADC_A_DATA8_P (out), ADC_A_DATA10_N (out), ADC_A_DATA10_P (out), ADC_A_DATA12_N (out), ADC_A_DATA12_P (out), ADC_B_DATA0_N (out), ADC_B_DATA0_P (out), ADC_B_DATA2_N (out), ADC_B_DATA2_P (out), ADC_B_DATA4_N (out), ADC_B_DATA4_P (out), ADC_B_DATA6_N (out), ADC_B_DATA6_P (out), ADC_B_DATA8_N (out), ADC_B_DATA8_P (out), ADC_B_DATA10_N (out), ADC_B_DATA10_P (out), ADC_B_DATA12_N (out), ADC_B_DATA12_P (out), ADC_DCLK_N (out), ADC_DCLK_P (out), ADC_IN0_N (in), ADC_IN0_P (in), ADC_IN1_N (in), ADC_IN1_P (in), ADC_RESET_H (in), ADC_SCLK (in), ADC_SDATA (in), ADC_SDOUT (out), ADC_SEN (in), ADC_VCOM (out), CDCE_CLK_200M_N (in), CDCE_CLK_200M_P (in)

### Nets
ADC_A_DATA0_N: U1.60(DB0M) ; port ADC_A_DATA0_N
ADC_A_DATA0_P: U1.61(DB0P) ; port ADC_A_DATA0_P
ADC_A_DATA2_N: U1.62(DB2M) ; port ADC_A_DATA2_N
ADC_A_DATA2_P: U1.63(DB2P) ; port ADC_A_DATA2_P
ADC_A_DATA4_N: U1.2(DB4M) ; port ADC_A_DATA4_N
ADC_A_DATA4_P: U1.3(DB4P) ; port ADC_A_DATA4_P
ADC_A_DATA6_N: U1.4(DB6M) ; port ADC_A_DATA6_N
ADC_A_DATA6_P: U1.5(DB6P) ; port ADC_A_DATA6_P
ADC_A_DATA8_N: U1.6(DB8M) ; port ADC_A_DATA8_N
ADC_A_DATA8_P: U1.7(DB8P) ; port ADC_A_DATA8_P
ADC_A_DATA10_N: U1.8(DB10M) ; port ADC_A_DATA10_N
ADC_A_DATA10_P: U1.9(DB10P) ; port ADC_A_DATA10_P
ADC_A_DATA12_N: U1.10(DB12M) ; port ADC_A_DATA12_N
ADC_A_DATA12_P: U1.11(DB12P) ; port ADC_A_DATA12_P
ADC_B_DATA0_N: U1.40(DA0M) ; port ADC_B_DATA0_N
ADC_B_DATA0_P: U1.41(DA0P) ; port ADC_B_DATA0_P
ADC_B_DATA2_N: U1.42(DA2M) ; port ADC_B_DATA2_N
ADC_B_DATA2_P: U1.43(DA2P) ; port ADC_B_DATA2_P
ADC_B_DATA4_N: U1.44(DA4M) ; port ADC_B_DATA4_N
ADC_B_DATA4_P: U1.45(DA4P) ; port ADC_B_DATA4_P
ADC_B_DATA6_N: U1.46(DA6M) ; port ADC_B_DATA6_N
ADC_B_DATA6_P: U1.47(DA6P) ; port ADC_B_DATA6_P
ADC_B_DATA8_N: U1.50(DA8M) ; port ADC_B_DATA8_N
ADC_B_DATA8_P: U1.51(DA8P) ; port ADC_B_DATA8_P
ADC_B_DATA10_N: U1.52(DA10M) ; port ADC_B_DATA10_N
ADC_B_DATA10_P: U1.53(DA10P) ; port ADC_B_DATA10_P
ADC_B_DATA12_N: U1.54(DA12M) ; port ADC_B_DATA12_N
ADC_B_DATA12_P: U1.55(DA12P) ; port ADC_B_DATA12_P
ADC_DCLK_N: U1.56(CLKOUTM) ; port ADC_DCLK_N
ADC_DCLK_P: U1.57(CLKOUTP) ; port ADC_DCLK_P
ADC_IN0_N: R4.2 ; port ADC_IN0_N
ADC_IN0_P: R3.2 ; port ADC_IN0_P
ADC_IN1_N: R6.2 ; port ADC_IN1_N
ADC_IN1_P: R5.2 ; port ADC_IN1_P
ADC_VCOM: U1.23(CM) ; port ADC_VCOM
CDCE_CLK_200M_N: C2.1 U1.26(CLKM)
CDCE_CLK_200M_P: C1.1 U1.25(CLKP)
NetC1_2: C1.2 R1.2 ; port CDCE_CLK_200M_P
NetC2_2: C2.2 R1.1 ; port CDCE_CLK_200M_N
NetJ5_E22: R2.1 ; port ADC_SDOUT
NetJ5_F22: U1.14(SDATA) ; port ADC_SDATA
NetJ5_F23: U1.15(SEN) ; port ADC_SEN
NetJ5_J24: U1.13(SCLK) ; port ADC_SCLK
NetJ5_J25: U1.12(RESET) ; port ADC_RESET_H
NetR2_2: R2.2 U1.64(SDOUT)
NetR3_1: R3.1 U1.19(INP_B)
NetR4_1: R4.1 U1.20(INM_B)
NetR5_1: R5.1 U1.29(INP_A)
NetR6_1: R6.1 U1.30(INM_A)

Not connected (* = marked no-connect by the designer): U1 22(NC)* 35(CTRL1)* 36(CTRL2)* 37(CTRL3)*

### Layout directives
differential pair: ADC_A_DATA0_N, ADC_A_DATA0_P, ADC_A_DATA2_N, ADC_A_DATA2_P, ADC_A_DATA4_N, ADC_A_DATA4_P, ADC_A_DATA6_N, ADC_A_DATA6_P, ADC_A_DATA8_N, ADC_A_DATA8_P, ADC_A_DATA10_N, ADC_A_DATA10_P, ADC_A_DATA12_N, ADC_A_DATA12_P, ADC_B_DATA0_N, ADC_B_DATA0_P, ADC_B_DATA2_N, ADC_B_DATA2_P, ADC_B_DATA4_N, ADC_B_DATA4_P, ADC_B_DATA6_N, ADC_B_DATA6_P, ADC_B_DATA8_N, ADC_B_DATA8_P, ADC_B_DATA10_N, ADC_B_DATA10_P, ADC_B_DATA12_N, ADC_B_DATA12_P, ADC_DCLK_N, ADC_DCLK_P, ADC_IN0_N, ADC_IN0_P, ADC_IN1_N, ADC_IN1_P, CDCE_CLK_200M_N, CDCE_CLK_200M_P

### Notes on the sheet
- (near R1) LVDS operation Clock
- (near U1) CONNECT TO FPGA WITH CLOCK COMPATIBLE
- (near U1) Internally matched 100 Ohm LVDS
- Internally matched 100 Ohm LVDS
- (near U1) CTRL[1..3] have internal pull-down
- (near R3) Close to Filters
- 2x14 bit ADCs with 200MHz sampling
- We use the Digital mode for the device to interface with the FPGA
- IOs are 1.8V S/E standard
- 2MHz Serial Clock for config
- (near R5) Close to Filters
- Sheet Name
- Project Title
- Global Project
- Size
- Group
- Revision
- Date
- Sheet
- of
- Filename
- Designers
- (in symbol ADC_ADS62P48IRGCT, part A) ADC
- (in symbol ADC_ADS62P48IRGCT, part B) ADC

### Library data of the parts
C1 C2 = CAP - 0402: Precision: 10%; Current: *; CreatedBy: Jonathan Bouchard; Power: *
R1-R6 = RES - 0402: Voltage: 50V; Power: 1/16W; Current: *; CreatedBy: Jonathan Bouchard
U1 = ADC_ADS62P48IRGCT: ADC - 14 BIT 210MSPS SUAL - VQFN-64; Voltage: 3.15 V ~ 3.6 V / 1.7 V ~ 1.9 V; Mfg: Texas Instruments; Precision: 14 Bit; Current: *; Power: *; Mfg Part Number: ADS62P48IRGCT; HelpURL: http://www.ti.com/lit/ds/symlink/ads62p48.pdf; CreatedBy: Jonathan Bouchard; Temperature: -40°C ~ 85°C; Value: *; Package: VQFN-64; Supplier 1: Digikey; Supplier Part Number 1: 296-24611-1-ND

## Sheet CF_ADC_Supply.SchDoc
size Tabloid; DocumentNumber: 7; SheetNumber: 7; SheetTotal: 10; Sheet_Name: CF_ADC_Supply; Size: 11x17
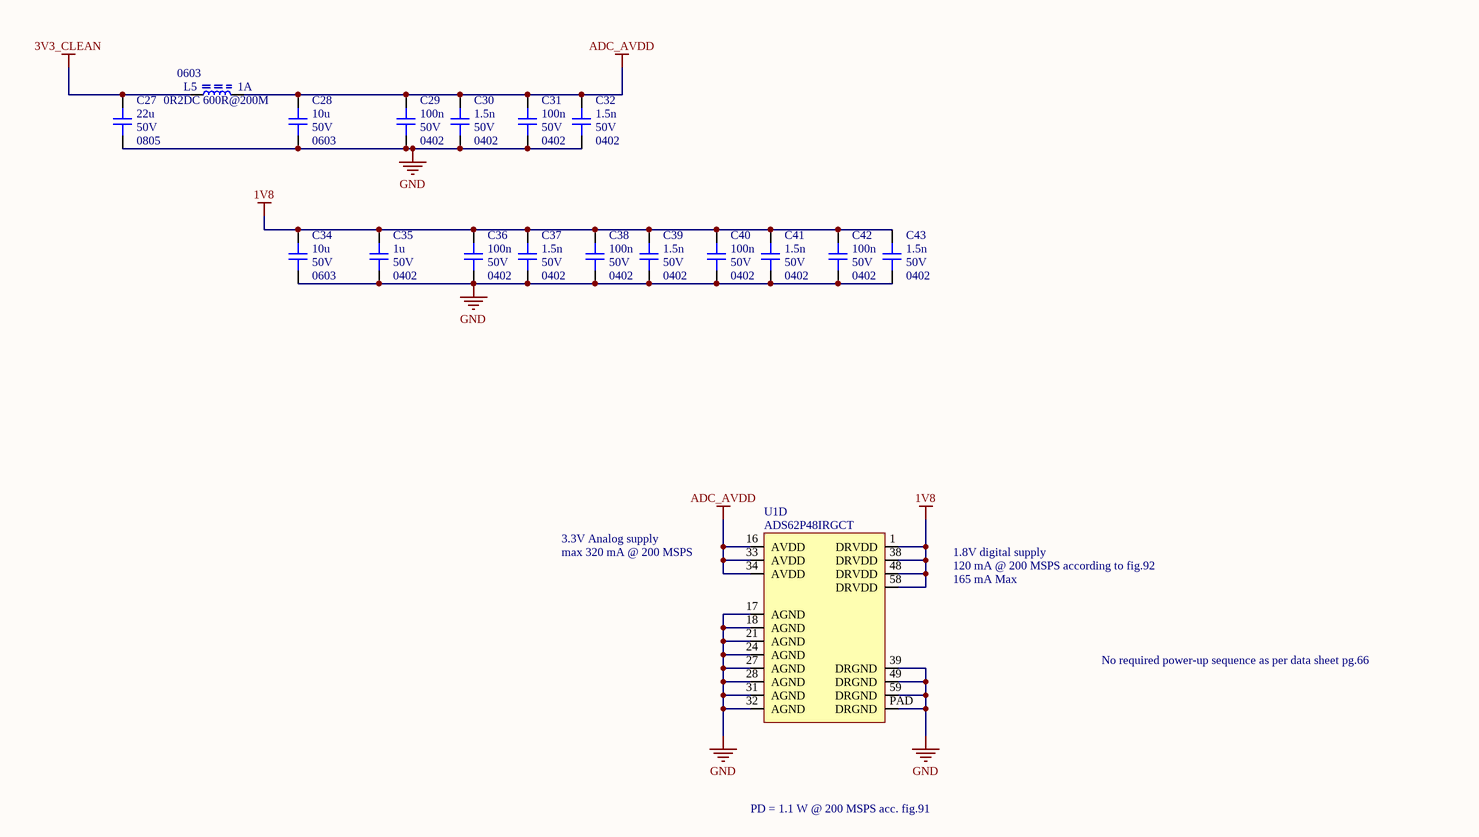
[diagram p6: CF_ADC_Supply.SchDoc]

### Parts
C27  value 22u  Voltage: 50V  Package: 0805  [CAP_0805]  (hidden comment: CAP - 0805)
C28  value 10u  Voltage: 50V  Package: 0603  [CAP_0603]  (hidden comment: CAP - 0603)
C29  value 100n  Voltage: 50V  Package: 0402  [CAP_0402]  (hidden comment: CAP - 0402)
C30  value 1.5n  Voltage: 50V  Package: 0402  [CAP_0402]  (hidden comment: CAP - 0402)
C31  value 100n  Voltage: 50V  Package: 0402  [CAP_0402]  (hidden comment: CAP - 0402)
C32  value 1.5n  Voltage: 50V  Package: 0402  [CAP_0402]  (hidden comment: CAP - 0402)
C34  value 10u  Voltage: 50V  Package: 0603  [CAP_0603]  (hidden comment: CAP - 0603)
C35  value 1u  Voltage: 50V  Package: 0402  [CAP_0402]  (hidden comment: CAP - 0402)
C36  value 100n  Voltage: 50V  Package: 0402  [CAP_0402]  (hidden comment: CAP - 0402)
C37  value 1.5n  Voltage: 50V  Package: 0402  [CAP_0402]  (hidden comment: CAP - 0402)
C38  value 100n  Voltage: 50V  Package: 0402  [CAP_0402]  (hidden comment: CAP - 0402)
C39  value 1.5n  Voltage: 50V  Package: 0402  [CAP_0402]  (hidden comment: CAP - 0402)
C40  value 100n  Voltage: 50V  Package: 0402  [CAP_0402]  (hidden comment: CAP - 0402)
C41  value 1.5n  Voltage: 50V  Package: 0402  [CAP_0402]  (hidden comment: CAP - 0402)
C42  value 100n  Voltage: 50V  Package: 0402  [CAP_0402]  (hidden comment: CAP - 0402)
C43  value 1.5n  Voltage: 50V  Package: 0402  [CAP_0402]  (hidden comment: CAP - 0402)
L5  value 0R2DC 600R@200M  Current: 1A  Package: 0603  [FER_0603]  (hidden comment: FER - 0603)
U1  ADS62P48IRGCT  [ADC_ADS62P48IRGCT]  (part D of 4)

### Nets
1V8: C34.2 C35.2 C36.2 C37.2 C38.2 C39.2 C40.2 C41.2 C42.2 C43.2 U1.1(DRVDD) U1.38(DRVDD) U1.48(DRVDD) U1.58(DRVDD)
3V3_CLEAN: C27.2 L5.2
ADC_AVDD: C28.2 C29.2 C30.2 C31.2 C32.2 L5.1 U1.16(AVDD) U1.33(AVDD) U1.34(AVDD)
GND: C27.1 C28.1 C29.1 C30.1 C31.1 C32.1 C34.1 C35.1 C36.1 C37.1 C38.1 C39.1 C40.1 C41.1 C42.1 C43.1 U1.17(AGND) U1.18(AGND) U1.21(AGND) U1.24(AGND) U1.27(AGND) U1.28(AGND) U1.31(AGND) U1.32(AGND) U1.39(DRGND) U1.49(DRGND) U1.59(DRGND) U1.PAD(DRGND)

### Notes on the sheet
- max 320 mA @ 200 MSPS
- 3.3V Analog supply
- 120 mA @ 200 MSPS according to fig.92
- 1.8V digital supply
- 165 mA Max
- No required power-up sequence as per data sheet pg.66
- PD = 1.1 W @ 200 MSPS acc. fig.91
- Sheet Name
- Project Title
- Global Project
- Size
- Group
- Revision
- Date
- Sheet
- of
- Filename
- Designers

### Library data of the parts
C27 = CAP - 0805: Precision: 10%; Current: *; CreatedBy: Jonathan Bouchard; Power: *
C28 C34 = CAP - 0603: Mfg Part Number: C1005X5R0J106M050BC; Precision: 10%; Current: *; CreatedBy: Jonathan Bouchard; Power: *
C29 C31 C36 C38 C40 C42 = CAP - 0402: Mfg Part Number: C0603X5R1E104K030BB; Precision: 10%; Current: *; CreatedBy: Jonathan Bouchard; Power: *
C30 C32 C37 C39 C41 C43 = CAP - 0402: Mfg Part Number: C0603X5R1E152M030BA; Precision: 10%; Current: *; CreatedBy: Jonathan Bouchard; Power: *
C35 = CAP - 0402: Mfg Part Number: C0603X5R0J105M030BC; Precision: 10%; Current: *; CreatedBy: Jonathan Bouchard; Power: *
L5 = FER - 0603: Mfg Part Number: 782633601; Mfg: Würth Elektronik; Voltage: *; CreatedBy: Jonathan Bouchard; Power: *; Precision: *
U1 = ADC_ADS62P48IRGCT: as U1 on sheet CF_ADC; Current: *; Power: *; Mfg Part Number: ADS62P48IRGCT; HelpURL: http://www.ti.com/lit/ds/symlink/ads62p48.pdf; CreatedBy: Jonathan Bouchard; Temperature: -40°C ~ 85°C; Value: *; Package: VQFN-64; Supplier 1: Digikey; Supplier Part Number 1: 296-24611-1-ND

## Sheet CF_ADC_filter.SchDoc
size Tabloid; DocumentNumber: 8; SheetNumber: 8; SheetTotal: 10; Sheet_Name: CF_ADC_FILTER; Size: 11x17
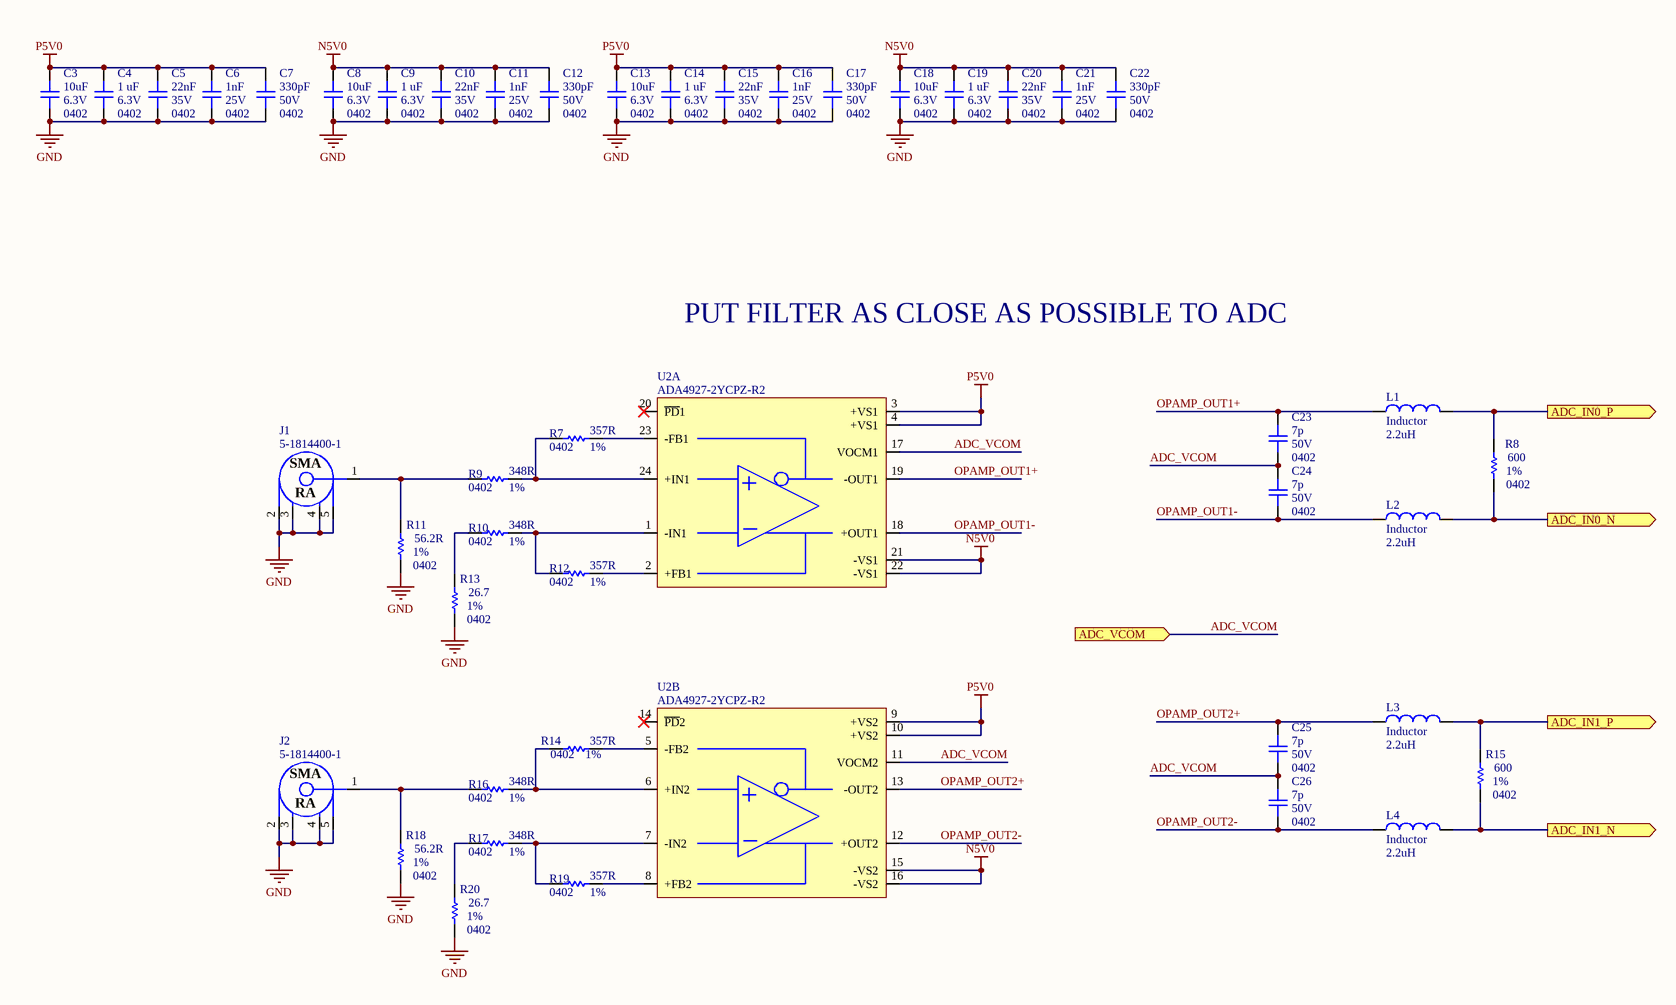
[diagram p7: CF_ADC_filter.SchDoc]

### Parts
C3  value 10uF  Voltage: 6.3V  Package: 0402  [CAP_0402]  (hidden comment: CAP - 0402)
C4  value 1 uF  Voltage: 6.3V  Package: 0402  [CAP_0402]  (hidden comment: CAP - 0402)
C5  value 22nF  Voltage: 35V  Package: 0402  [CAP_0402]  (hidden comment: CAP - 0402)
C6  value 1nF  Voltage: 25V  Package: 0402  [CAP_0402]  (hidden comment: CAP - 0402)
C7  value 330pF  Voltage: 50V  Package: 0402  [CAP_0402]  (hidden comment: CAP - 0402)
C8  value 10uF  Voltage: 6.3V  Package: 0402  [CAP_0402]  (hidden comment: CAP - 0402)
C9  value 1 uF  Voltage: 6.3V  Package: 0402  [CAP_0402]  (hidden comment: CAP - 0402)
C10  value 22nF  Voltage: 35V  Package: 0402  [CAP_0402]  (hidden comment: CAP - 0402)
C11  value 1nF  Voltage: 25V  Package: 0402  [CAP_0402]  (hidden comment: CAP - 0402)
C12  value 330pF  Voltage: 50V  Package: 0402  [CAP_0402]  (hidden comment: CAP - 0402)
C13  value 10uF  Voltage: 6.3V  Package: 0402  [CAP_0402]  (hidden comment: CAP - 0402)
C14  value 1 uF  Voltage: 6.3V  Package: 0402  [CAP_0402]  (hidden comment: CAP - 0402)
C15  value 22nF  Voltage: 35V  Package: 0402  [CAP_0402]  (hidden comment: CAP - 0402)
C16  value 1nF  Voltage: 25V  Package: 0402  [CAP_0402]  (hidden comment: CAP - 0402)
C17  value 330pF  Voltage: 50V  Package: 0402  [CAP_0402]  (hidden comment: CAP - 0402)
C18  value 10uF  Voltage: 6.3V  Package: 0402  [CAP_0402]  (hidden comment: CAP - 0402)
C19  value 1 uF  Voltage: 6.3V  Package: 0402  [CAP_0402]  (hidden comment: CAP - 0402)
C20  value 22nF  Voltage: 35V  Package: 0402  [CAP_0402]  (hidden comment: CAP - 0402)
C21  value 1nF  Voltage: 25V  Package: 0402  [CAP_0402]  (hidden comment: CAP - 0402)
C22  value 330pF  Voltage: 50V  Package: 0402  [CAP_0402]  (hidden comment: CAP - 0402)
C23  value 7p  Voltage: 50V  Package: 0402  [CAP_0402]  (hidden comment: CAP - 0402)
C24  value 7p  Voltage: 50V  Package: 0402  [CAP_0402]  (hidden comment: CAP - 0402)
C25  value 7p  Voltage: 50V  Package: 0402  [CAP_0402]  (hidden comment: CAP - 0402)
C26  value 7p  Voltage: 50V  Package: 0402  [CAP_0402]  (hidden comment: CAP - 0402)
J1  5-1814400-1  [CONN_SMA_5-1814400-1]
J2  5-1814400-1  [CONN_SMA_5-1814400-1]
L1  Inductor  value 2.2uH  [0402-A]
L2  Inductor  value 2.2uH  [0402-A]
L3  Inductor  value 2.2uH  [0402-A]
L4  Inductor  value 2.2uH  [0402-A]
R7  value 357R  Package: 0402  Precision: 1%  [RES_0402]  (hidden comment: RES - 0402)
R8  value 600  Package: 0402  Precision: 1%  [RES_0402]  (hidden comment: RES - 0402)
R9  value 348R  Package: 0402  Precision: 1%  [RES_0402]  (hidden comment: RES - 0402)
R10  value 348R  Package: 0402  Precision: 1%  [RES_0402]  (hidden comment: RES - 0402)
R11  value 56.2R  Package: 0402  Precision: 1%  [RES_0402]  (hidden comment: RES - 0402)
R12  value 357R  Package: 0402  Precision: 1%  [RES_0402]  (hidden comment: RES - 0402)
R13  value 26.7  Package: 0402  Precision: 1%  [RES_0402]  (hidden comment: RES - 0402)
R14  value 357R  Package: 0402  Precision: 1%  [RES_0402]  (hidden comment: RES - 0402)
R15  value 600  Package: 0402  Precision: 1%  [RES_0402]  (hidden comment: RES - 0402)
R16  value 348R  Package: 0402  Precision: 1%  [RES_0402]  (hidden comment: RES - 0402)
R17  value 348R  Package: 0402  Precision: 1%  [RES_0402]  (hidden comment: RES - 0402)
R18  value 56.2R  Package: 0402  Precision: 1%  [RES_0402]  (hidden comment: RES - 0402)
R19  value 357R  Package: 0402  Precision: 1%  [RES_0402]  (hidden comment: RES - 0402)
R20  value 26.7  Package: 0402  Precision: 1%  [RES_0402]  (hidden comment: RES - 0402)
U2  ADA4927-2YCPZ-R2  [OPAMP_ADA4927-2YCPZ-R2]  (parts A,B of 2)

### Ports
ADC_IN0_N (out), ADC_IN0_P (out), ADC_IN1_N (out), ADC_IN1_P (out), ADC_VCOM (in)

### Nets
GND: C3.1 C4.1 C5.1 C6.1 C7.1 C8.1 C9.1 C10.1 C11.1 C12.1 C13.1 C14.1 C15.1 C16.1 C17.1 C18.1 C19.1 C20.1 C21.1 C22.1 J1.2 J1.3 J1.4 J1.5 J2.2 J2.3 J2.4 J2.5 R11.1 R13.1 R18.1 R20.1
N5V0: C8.2 C9.2 C10.2 C11.2 C12.2 C18.2 C19.2 C20.2 C21.2 C22.2 U2.15(-VS2) U2.16(-VS2) U2.21(-VS1) U2.22(-VS1)
P5V0: C3.2 C4.2 C5.2 C6.2 C7.2 C13.2 C14.2 C15.2 C16.2 C17.2 U2.3(+VS1) U2.4(+VS1) U2.9(+VS2) U2.10(+VS2)
ADC_IN0_N: L2.2 R8.1 ; port ADC_IN0_N
ADC_IN0_P: L1.2 R8.2 ; port ADC_IN0_P
ADC_IN1_N: L4.2 R15.1 ; port ADC_IN1_N
ADC_IN1_P: L3.2 R15.2 ; port ADC_IN1_P
ADC_VCOM: C23.1 C24.2 C25.1 C26.2 U2.11(VOCM2) U2.17(VOCM1) ; port ADC_VCOM
OPAMP_OUT1+: C23.2 L1.1 U2.19(-OUT1)
OPAMP_OUT1-: C24.1 L2.1 U2.18(+OUT1)
OPAMP_OUT2+: C25.2 L3.1 U2.13(-OUT2)
OPAMP_OUT2-: C26.1 L4.1 U2.12(+OUT2)
NetJ1_1: J1.1 R9.2 R11.2
NetJ2_1: J2.1 R16.2 R18.2
NetR7_1: R7.1 U2.23(-FB1)
NetR7_2: R7.2 R9.1 U2.24(+IN1)
NetR10_1: R10.1 R12.2 U2.1(-IN1)
NetR10_2: R10.2 R13.2
NetR12_1: R12.1 U2.2(+FB1)
NetR14_1: R14.1 U2.5(-FB2)
NetR14_2: R14.2 R16.1 U2.6(+IN2)
NetR17_1: R17.1 R19.2 U2.7(-IN2)
NetR17_2: R17.2 R20.2
NetR19_1: R19.1 U2.8(+FB2)

Not connected (* = marked no-connect by the designer): U2 14(~{PD}2)* 20(~{PD}1)*

### Notes on the sheet
- PUT FILTER AS CLOSE AS POSSIBLE TO ADC
- Sheet Name
- Project Title
- Global Project
- Size
- Group
- Revision
- Date
- Sheet
- of
- Filename
- Designers
- (in symbol CONN_SMA_5-1814400-1) SMA; RA

### Library data of the parts
C3-C26 = CAP - 0402: Precision: 10%; Current: *; CreatedBy: Jonathan Bouchard; Power: *
J1 J2 = CONN_SMA_5-1814400-1: as J3 on sheet CF_DAC_FILTER; Voltage: *; Current: *; Power: *; Mfg Part Number: 5-1814400-1; HelpURL: http://www.te.com/commerce/DocumentDelivery/DDEController?Action=srchrtrv&DocNm=1814400&DocType=Customer+Drawing&DocLang=English; CreatedBy: Jonathan Bouchard; Temperature: -55°C ~ 85°C; Value: *; Precision: *; Package: TH-5; Supplier 1: Digikey; Supplier Part Number 1: A97593-ND
L1-L4 = Inductor: Code_IEC: 1005; Published: 8-Jun-2000; LatestRevisionDate: 29-May-2009; LatestRevisionNote: IPC-7351 Footprint Added.; PackageReference: 0402-A; Publisher: Altium Limited; PackageDescription: Chip Inductor; Code_JEITA: 0402
R7-R20 = RES - 0402: Voltage: 50V; Power: 1/16W; Current: *; CreatedBy: Jonathan Bouchard
U2 = OPAMP_ADA4927-2YCPZ-R2: OPAMP - CFA 2.3GHZ - QFN-24; Voltage: 4.5 V ~ 11 V, ±2.25 V ~ 5.5 V; Current: 65mA; Mfg: Analog Devices; Power: *; Mfg Part Number: ADA4927-2YCPZ-R2; HelpURL: http://www.analog.com/media/en/technical-documentation/data-sheets/ADA4927-1_4927-2.pdf; CreatedBy: Jonathan Bouchard; Temperature: -40°C ~ 105°C; Value: *; Precision: *; Package: QFN-24; Supplier 1: Digikey; Supplier Part Number 1: ADA4927-2YCPZ-R2CT-ND

## Sheet CF_FMC_ABC.SchDoc
size Tabloid; DocumentNumber: 9; SheetNumber: 9; SheetTotal: 10; Sheet_Name: CF_FMC_ABC; Size: 11x17
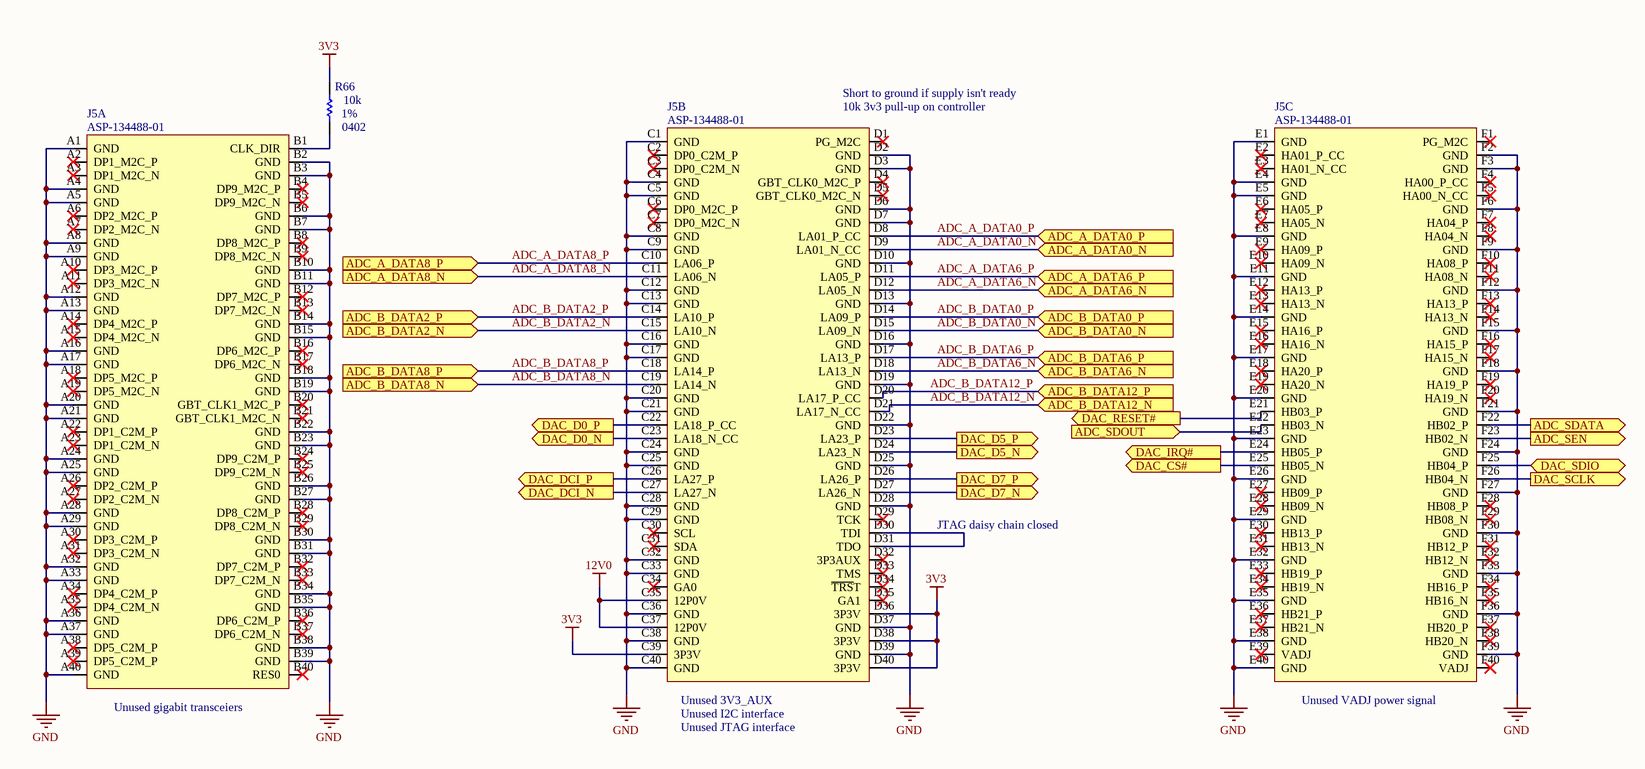
[diagram p8: CF_FMC_ABC.SchDoc]

### Parts
J5  ASP-134488-01  [CONN_SAMTEC_ASP-134488-01]  (parts A,B,C of 5)
R66  value 10k  Package: 0402  Precision: 1%  [RES_0402]  (hidden comment: RES - 0402)

### Ports
ADC_A_DATA0_N (in), ADC_A_DATA0_P (in), ADC_A_DATA6_N (in), ADC_A_DATA6_P (in), ADC_A_DATA8_N (in), ADC_A_DATA8_P (in), ADC_B_DATA0_N (in), ADC_B_DATA0_P (in), ADC_B_DATA2_N (in), ADC_B_DATA2_P (in), ADC_B_DATA6_N (in), ADC_B_DATA6_P (in), ADC_B_DATA8_N (in), ADC_B_DATA8_P (in), ADC_B_DATA12_N (in), ADC_B_DATA12_P (in), ADC_SDATA (out), ADC_SDOUT (in), ADC_SEN (out), DAC_CS# (out), DAC_D0_N (out), DAC_D0_P (out), DAC_D5_N (out), DAC_D5_P (out), DAC_D7_N (out), DAC_D7_P (out), DAC_DCI_N (out), DAC_DCI_P (out), DAC_IRQ# (out), DAC_RESET# (out), DAC_SCLK (out), DAC_SDIO (bidir)

### Nets
3V3: J5.C39(3P3V) J5.D36(3P3V) J5.D38(3P3V) J5.D40(3P3V) R66.2
12V0: J5.C35(12P0V) J5.C37(12P0V)
GND: J5.A1(GND) J5.A4(GND) J5.A5(GND) J5.A8(GND) J5.A9(GND) J5.A12(GND) J5.A13(GND) J5.A16(GND) J5.A17(GND) J5.A20(GND) J5.A21(GND) J5.A24(GND) J5.A25(GND) J5.A28(GND) J5.A29(GND) J5.A32(GND) J5.A33(GND) J5.A36(GND) J5.A37(GND) J5.A40(GND) J5.B2(GND) J5.B3(GND) J5.B6(GND) J5.B7(GND) J5.B10(GND) J5.B11(GND) J5.B14(GND) J5.B15(GND) J5.B18(GND) J5.B19(GND) J5.B22(GND) J5.B23(GND) J5.B26(GND) J5.B27(GND) J5.B30(GND) J5.B31(GND) J5.B34(GND) J5.B35(GND) J5.B38(GND) J5.B39(GND) J5.C1(GND) J5.C4(GND) J5.C5(GND) J5.C8(GND) J5.C9(GND) J5.C12(GND) J5.C13(GND) J5.C16(GND) J5.C17(GND) J5.C20(GND) J5.C21(GND) J5.C24(GND) J5.C25(GND) J5.C28(GND) J5.C29(GND) J5.C32(GND) J5.C33(GND) J5.C36(GND) J5.C38(GND) J5.C40(GND) J5.D2(GND) J5.D3(GND) J5.D6(GND) J5.D7(GND) J5.D10(GND) J5.D13(GND) J5.D16(GND) J5.D19(GND) J5.D22(GND) J5.D25(GND) J5.D28(GND) J5.D37(GND) J5.D39(GND) J5.E1(GND) J5.E4(GND) J5.E5(GND) J5.E8(GND) J5.E11(GND) J5.E14(GND) J5.E17(GND) J5.E20(GND) J5.E23(GND) J5.E26(GND) J5.E29(GND) J5.E32(GND) J5.E35(GND) J5.E38(GND) J5.E40(GND) J5.F2(GND) J5.F3(GND) J5.F6(GND) J5.F9(GND) J5.F12(GND) J5.F15(GND) J5.F18(GND) J5.F21(GND) J5.F24(GND) J5.F27(GND) J5.F30(GND) J5.F33(GND) J5.F36(GND) J5.F39(GND)
ADC_A_DATA0_N: J5.D9(LA01_N_CC) ; port ADC_A_DATA0_N
ADC_A_DATA0_P: J5.D8(LA01_P_CC) ; port ADC_A_DATA0_P
ADC_A_DATA6_N: J5.D12(LA05_N) ; port ADC_A_DATA6_N
ADC_A_DATA6_P: J5.D11(LA05_P) ; port ADC_A_DATA6_P
ADC_A_DATA8_N: J5.C11(LA06_N) ; port ADC_A_DATA8_N
ADC_A_DATA8_P: J5.C10(LA06_P) ; port ADC_A_DATA8_P
ADC_B_DATA0_N: J5.D15(LA09_N) ; port ADC_B_DATA0_N
ADC_B_DATA0_P: J5.D14(LA09_P) ; port ADC_B_DATA0_P
ADC_B_DATA2_N: J5.C15(LA10_N) ; port ADC_B_DATA2_N
ADC_B_DATA2_P: J5.C14(LA10_P) ; port ADC_B_DATA2_P
ADC_B_DATA6_N: J5.D18(LA13_N) ; port ADC_B_DATA6_N
ADC_B_DATA6_P: J5.D17(LA13_P) ; port ADC_B_DATA6_P
ADC_B_DATA8_N: J5.C19(LA14_N) ; port ADC_B_DATA8_N
ADC_B_DATA8_P: J5.C18(LA14_P) ; port ADC_B_DATA8_P
ADC_B_DATA12_N: J5.D21(LA17_N_CC) ; port ADC_B_DATA12_N
ADC_B_DATA12_P: J5.D20(LA17_P_CC) ; port ADC_B_DATA12_P
DAC_D0_N: J5.C23(LA18_N_CC) ; port DAC_D0_N
DAC_D0_P: J5.C22(LA18_P_CC) ; port DAC_D0_P
DAC_D5_N: J5.D24(LA23_N) ; port DAC_D5_N
DAC_D5_P: J5.D23(LA23_P) ; port DAC_D5_P
DAC_D7_N: J5.D27(LA26_N) ; port DAC_D7_N
DAC_D7_P: J5.D26(LA26_P) ; port DAC_D7_P
DAC_DCI_N: J5.C27(LA27_N) ; port DAC_DCI_N
DAC_DCI_P: J5.C26(LA27_P) ; port DAC_DCI_P
NetJ5_B1: J5.B1(CLK_DIR) R66.1
NetJ5_D30: J5.D30(TDI) J5.D31(TDO)
NetJ5_E21: J5.E21(HB03_P) ; port DAC_RESET#
NetJ5_E22: J5.E22(HB03_N) ; port ADC_SDOUT
NetJ5_E24: J5.E24(HB05_P) ; port DAC_IRQ#
NetJ5_E25: J5.E25(HB05_N) ; port DAC_CS#
NetJ5_F22: J5.F22(HB02_P) ; port ADC_SDATA
NetJ5_F23: J5.F23(HB02_N) ; port ADC_SEN
NetJ5_F25: J5.F25(HB04_P) ; port DAC_SDIO
NetJ5_F26: J5.F26(HB04_N) ; port DAC_SCLK

Not connected (* = marked no-connect by the designer): J5 A2(DP1_M2C_P)* A3(DP1_M2C_N)* A6(DP2_M2C_P)* A7(DP2_M2C_N)* A10(DP3_M2C_P)* A11(DP3_M2C_N)* A14(DP4_M2C_P)* A15(DP4_M2C_N)* A18(DP5_M2C_P)* A19(DP5_M2C_N)* A22(DP1_C2M_P)* A23(DP1_C2M_N)* A26(DP2_C2M_P)* A27(DP2_C2M_N)* A30(DP3_C2M_P)* A31(DP3_C2M_N)* A34(DP4_C2M_P)* A35(DP4_C2M_N)* A38(DP5_C2M_P)* A39(DP5_C2M_P)* B4(DP9_M2C_P)* B5(DP9_M2C_N)* B8(DP8_M2C_P)* B9(DP8_M2C_N)* B12(DP7_M2C_P)* B13(DP7_M2C_N)* B16(DP6_M2C_P)* B17(DP6_M2C_N)* B20(GBT_CLK1_M2C_P)* B21(GBT_CLK1_M2C_N)* B24(DP9_C2M_P)* B25(DP9_C2M_N)* B28(DP8_C2M_P)* B29(DP8_C2M_N)* B32(DP7_C2M_P)* B33(DP7_C2M_N)* B36(DP6_C2M_P)* B37(DP6_C2M_N)* B40(RES0)* C2(DP0_C2M_P)* C3(DP0_C2M_N)* C6(DP0_M2C_P)* C7(DP0_M2C_N)* C30(SCL)* C31(SDA)* C34(GA0)* D1(PG_M2C)* D4(GBT_CLK0_M2C_P)* D5(GBT_CLK0_M2C_N)* D29(TCK)* D32(3P3AUX)* D33(TMS)* D34(~{TRS}T)* D35(GA1)* E2(HA01_P_CC)* E3(HA01_N_CC)* E6(HA05_P)* E7(HA05_N)* E9(HA09_P)* E10(HA09_N)* E12(HA13_P)* E13(HA13_N)* E15(HA16_P)* E16(HA16_N)* E18(HA20_P)* E19(HA20_N)* E27(HB09_P)* E28(HB09_N)* E30(HB13_P)* E31(HB13_N)* E33(HB19_P)* E34(HB19_N)* E36(HB21_P)* E37(HB21_N)* E39(VADJ)* F1(PG_M2C)* F4(HA00_P_CC)* F5(HA00_N_CC)* F7(HA04_P)* F8(HA04_N)* F10(HA08_P)* F11(HA08_N)* F13(HA13_P)* F14(HA13_N)* F16(HA15_P)* F17(HA15_N)* F19(HA19_P)* F20(HA19_N)* F28(HB08_P)* F29(HB08_N)* F31(HB12_P)* F32(HB12_N)* F34(HB16_P)* F35(HB16_N)* F37(HB20_P)* F38(HB20_N)* F40(VADJ)*

### Notes on the sheet
- (near J5) Short to ground if supply isn't ready
- (near J5) 10k 3v3 pull-up on controller
- JTAG daisy chain closed
- (near J5) Unused gigabit transceiers
- (near J5) Unused 3V3_AUX
- (near J5) Unused I2C interface
- Unused JTAG interface
- (near J5) Unused VADJ power signal
- Sheet Name
- Project Title
- Global Project
- Size
- Group
- Revision
- Date
- Sheet
- of
- Filename
- Designers

### Library data of the parts
J5 = CONN_SAMTEC_ASP-134488-01: CONN - VITA 57 MEZZ MALE (DAUGHTERBOARD) HIGH DENSITY - SMD-400; Voltage: 240VAC; Current: 1.8A; Mfg: Samtec; Power: *; Mfg Part Number: ASP-134488-01; HelpURL: http://suddendocs.samtec.com/prints/asp-134488-01-mkt.pdf; CreatedBy: Jonathan Bouchard; Temperature: -55 °C to +125 °C; Value: *; Precision: *; Package: SMD-400
R66 = RES - 0402: Voltage: 50V; Power: 1/16W; Current: *; CreatedBy: Jonathan Bouchard